# Altium project OCP-TimeCardMini-TI.PrjPcb (part 1 of 6)
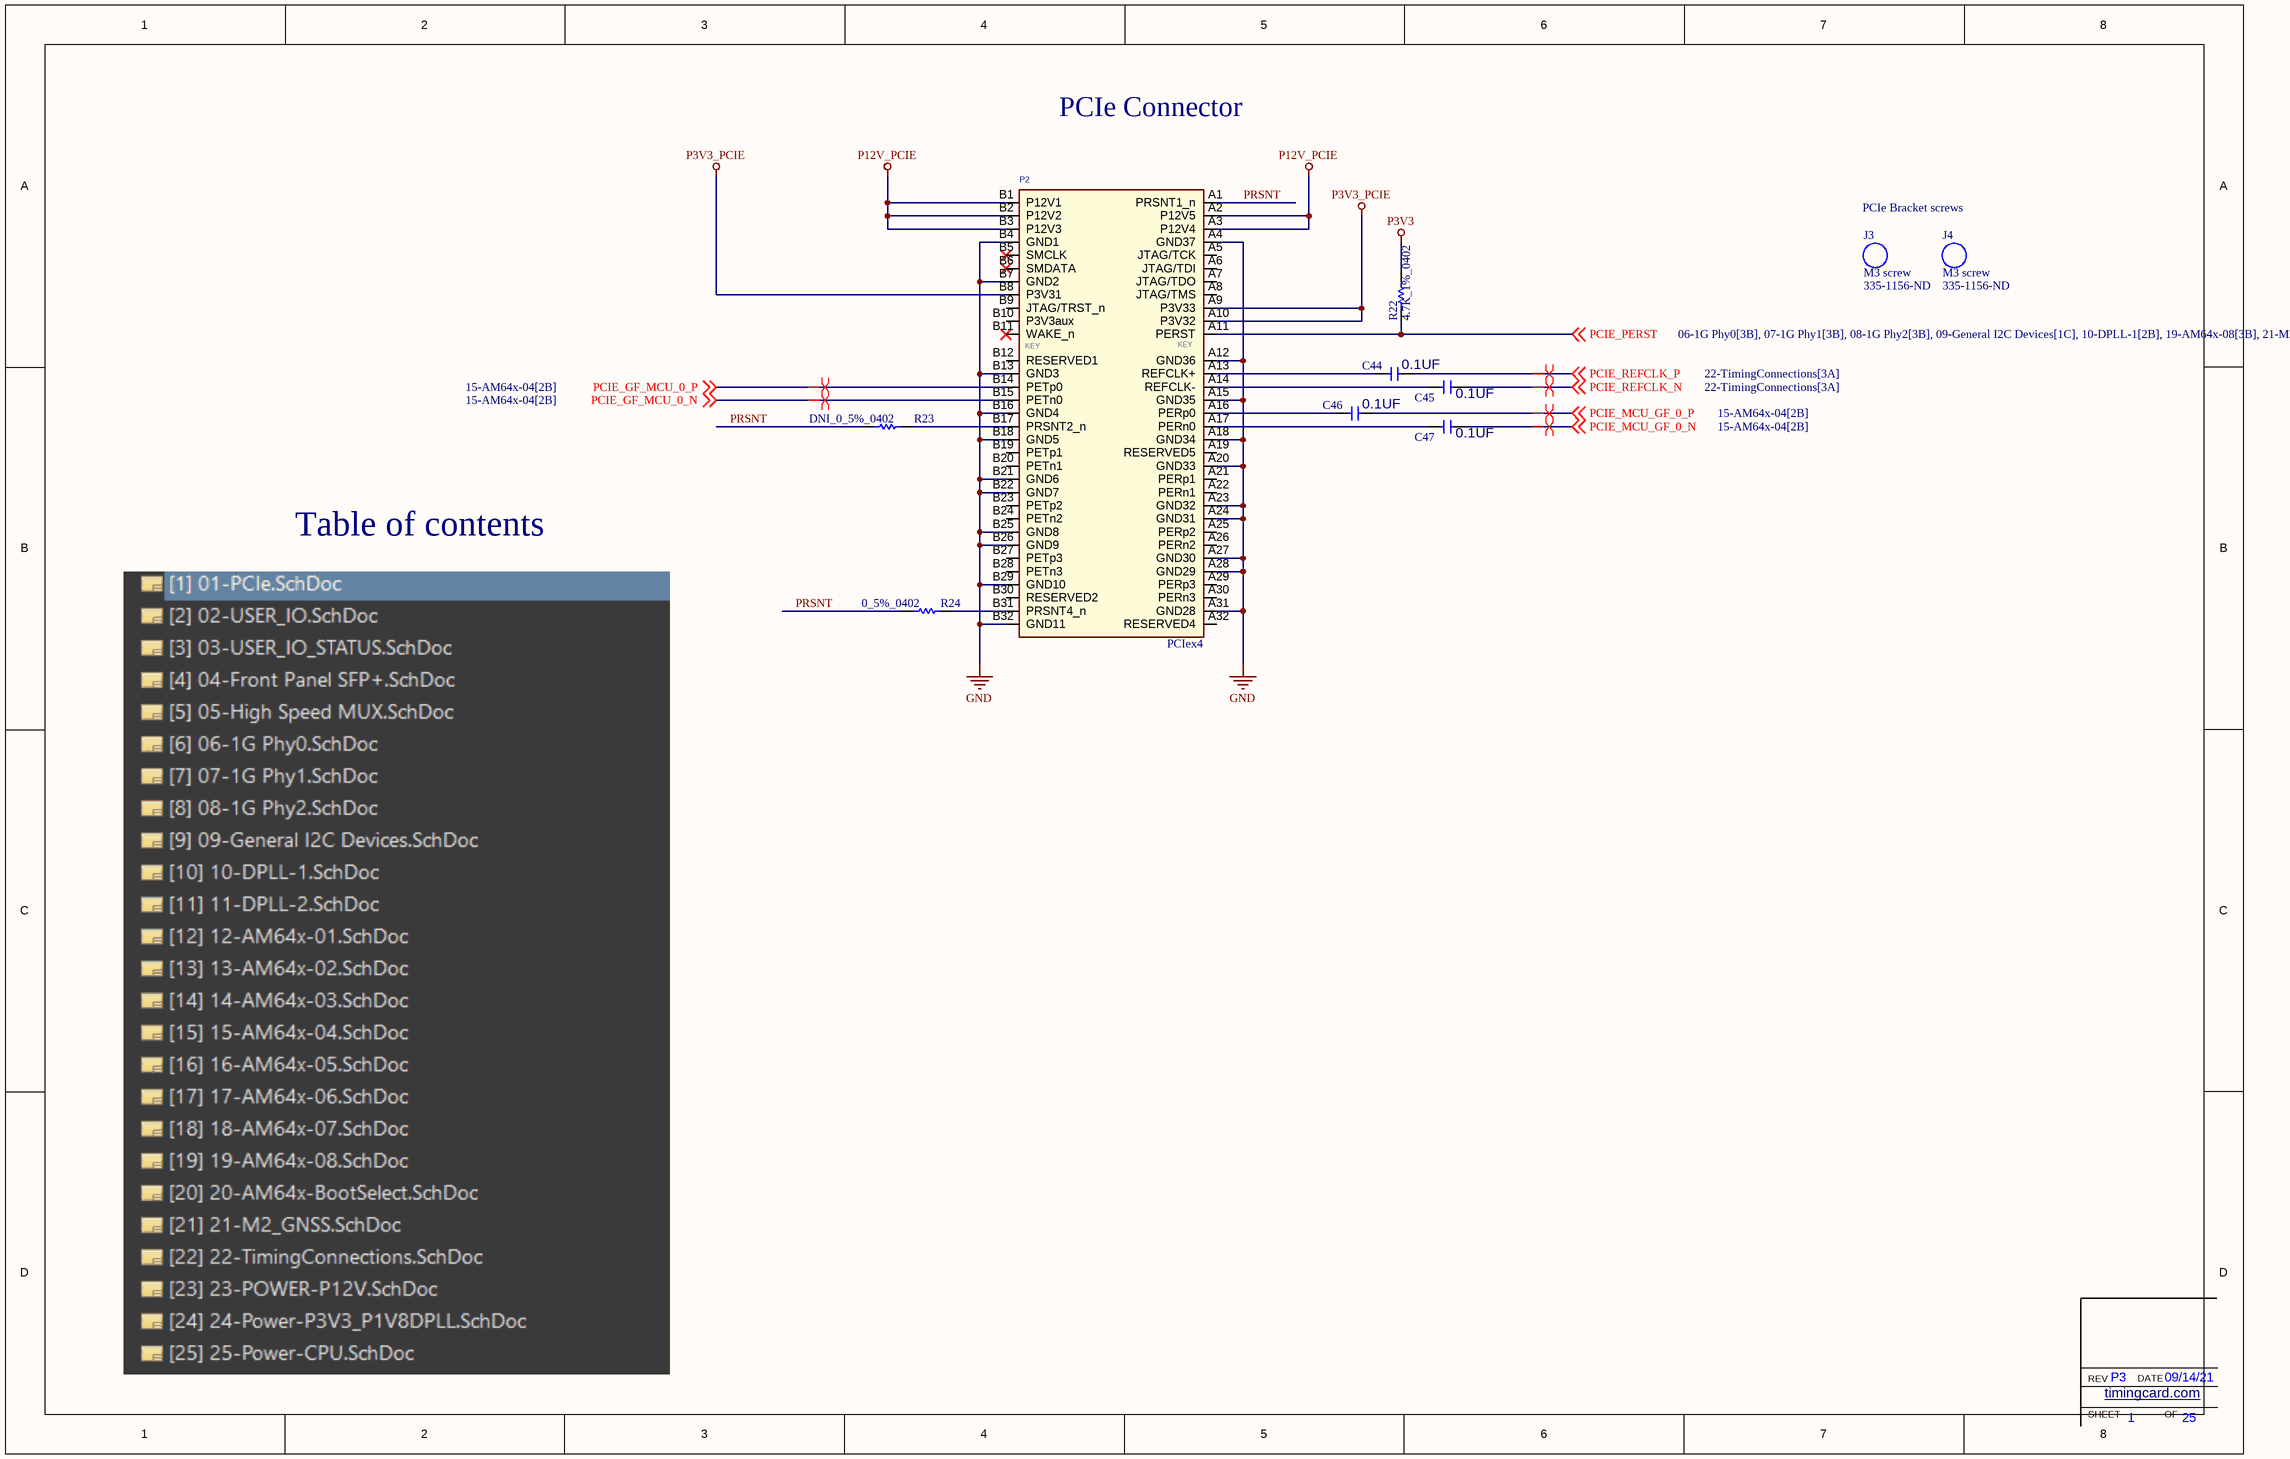
[diagram p0: 01-PCIe.SchDoc]
ProjectDate: 09/14/21; ProjectRevision: P3
25 sheets, 834 parts. Net scope: global (net labels, ports and power ports of the same name join across sheets).
Board file: OCP-TimeCardMini-TI_V1.PcbDoc
Sheets:
  01-PCIe.SchDoc
  02-USER_IO.SchDoc
  03-USER_IO_STATUS.SchDoc
  04-Front Panel SFP+.SchDoc
  05-High Speed MUX.SchDoc
  06-1G Phy0.SchDoc
  07-1G Phy1.SchDoc
  08-1G Phy2.SchDoc
  09-General I2C Devices.SchDoc
  10-DPLL-1.SchDoc
  11-DPLL-2.SchDoc
  12-AM64x-01.SchDoc
  13-AM64x-02.SchDoc
  14-AM64x-03.SchDoc
  15-AM64x-04.SchDoc
  16-AM64x-05.SchDoc
  17-AM64x-06.SchDoc
  18-AM64x-07.SchDoc
  19-AM64x-08.SchDoc
  20-AM64x-BootSelect.SchDoc
  21-M2_GNSS.SchDoc
  22-TimingConnections.SchDoc
  23-POWER-P12V.SchDoc
  24-Power-P3V3_P1V8DPLL.SchDoc
  25-Power-CPU.SchDoc

## Sheet 01-PCIe.SchDoc
size Tabloid; Customer: 01910; SheetNumber: 1; SheetTotal: 25

### Parts
C44  value 0.1UF  [CAPC1005X06N]  (hidden comment: CAP_0402_0.1UF_50V)
C45  value 0.1UF  [CAPC1005X06N]  (hidden comment: CAP_0402_0.1UF_50V)
C46  value 0.1UF  [CAPC1005X06N]  (hidden comment: CAP_0402_0.1UF_50V)
C47  value 0.1UF  [CAPC1005X06N]  (hidden comment: CAP_0402_0.1UF_50V)
J3  M3 screw  Supplier Part Number 1: 335-1156-ND
J4  M3 screw  Supplier Part Number 1: 335-1156-ND
P2  PCIex4  [PCIE_4LANE_EDGE]
R22  4.7K_1%_0402  [RESC1005X40X25NL10T10]
R23  DNI_0_5%_0402  [RESC1005X40X25LL10T10]  (no BOM)
R24  0_5%_0402  [RESC1005X40X25LL10T10]

### Nets
GND: P2.A4(GND37) P2.A12(GND36) P2.A15(GND35) P2.A18(GND34) P2.A20(GND33) P2.A23(GND32) P2.A24(GND31) P2.A27(GND30) P2.A28(GND29) P2.A31(GND28) P2.B4(GND1) P2.B7(GND2) P2.B13(GND3) P2.B16(GND4) P2.B18(GND5) P2.B21(GND6) P2.B22(GND7) P2.B25(GND8) P2.B26(GND9) P2.B29(GND10) P2.B32(GND11)
P3V3: R22.2
P3V3_PCIE: P2.A9(P3V33) P2.A10(P3V32) P2.B8(P3V31)
P12V_PCIE: P2.A2(P12V5) P2.A3(P12V4) P2.B1(P12V1) P2.B2(P12V2) P2.B3(P12V3)
PCIE_GF_MCU_0_N: P2.B15(PETn0) ; off-sheet PCIE_GF_MCU_0_N
PCIE_GF_MCU_0_P: P2.B14(PETp0) ; off-sheet PCIE_GF_MCU_0_P
PCIE_MCU_GF_0_N: C47.2 ; off-sheet PCIE_MCU_GF_0_N
PCIE_MCU_GF_0_P: C46.2 ; off-sheet PCIE_MCU_GF_0_P
PCIE_PERST: P2.A11(PERST) R22.1 ; off-sheet PCIE_PERST
PCIE_REFCLK_N: C45.2 ; off-sheet PCIE_REFCLK_N
PCIE_REFCLK_P: C44.2 ; off-sheet PCIE_REFCLK_P
PRSNT: P2.A1(PRSNT1_n) R23.1 R24.1
NetC44_1: C44.1 P2.A13(REFCLK+)
NetC45_1: C45.1 P2.A14(REFCLK-)
NetC46_1: C46.1 P2.A16(PERp0)
NetC47_1: C47.1 P2.A17(PERn0)
NetP2_B17: P2.B17(PRSNT2_n) R23.2
NetP2_B31: P2.B31(PRSNT4_n) R24.2

Not connected (* = marked no-connect by the designer): P2 A5(JTAG/TCK) A6(JTAG/TDI) A7(JTAG/TDO) A8(JTAG/TMS) A19(RESERVED5) A21(PERp1) A22(PERn1) A25(PERp2) A26(PERn2) A29(PERp3) A30(PERn3) A32(RESERVED4) B5(SMCLK)* B6(SMDATA)* B9(JTAG/TRST_n) B10(P3V3aux) B11(WAKE_n)* B12(RESERVED1) B19(PETp1) B20(PETn1) B23(PETp2) B24(PETn2) B27(PETp3) B28(PETn3) B30(RESERVED2)

### Layout directives
differential pair: PCIE_GF_MCU_0_N, PCIE_GF_MCU_0_P, PCIE_MCU_GF_0_N, PCIE_MCU_GF_0_P, PCIE_REFCLK_N, PCIE_REFCLK_P

### Notes on the sheet
- PCIe Connector
- PCIe Bracket screws
- Table of contents
- SHEET
- REV
- timingcard.com <http://timingcard.com>
- DATE
- OF
- (in symbol PCIex4) KEY

### Library data of the parts
C44-C47 = CAP_0402_0.1UF_50V: CAP, CER, 0.1UF, 50V, 10%, X7R, AEC-Q200, 0402; MFG PART NUM: CGA2B3X7R1H104K050BB; VALENTIUM PART NUM: <VALENTIUM>; MFG NAME: TDK; MAXTEMP: 125C; MINTEMP: -55C; CATEGORY: CAP, CER; MODIFY DATE: 10/23/2013; SHEETPART: *; P1: 10%; OTHER: AEC-Q200; P2: 50V; P3: X7R; Size: 0402; DESC: CAP, CER, 0.1UF, 50V, 10%, X7R, AEC-Q200, 0402; Supplier 1: Digi-Key; Supplier Part Number 1: 445-6899-1-ND
P2 = PCIex4: PCIE x4 Edge Connector,OrCAD Symbol,NC; Part Number: 451; Manufacturer: NA; NOTE: NC; Vendor P/N: NA; Part Type: SMT
R22 = CMP-2002-05217-1: Manufacturer: Bourns; Part Number: CR0402-FX-4701GLF
R23 R24 = CMP-2002-04569-1: Manufacturer: KOA Speer; Part Number: RK73Z1ETTP
J3 J4 = M3 screw: Supplier 1: Digi-Key

## Sheet 02-USER_IO.SchDoc
size Tabloid; DocumentNumber: 1; SheetNumber: 2; SheetTotal: 24
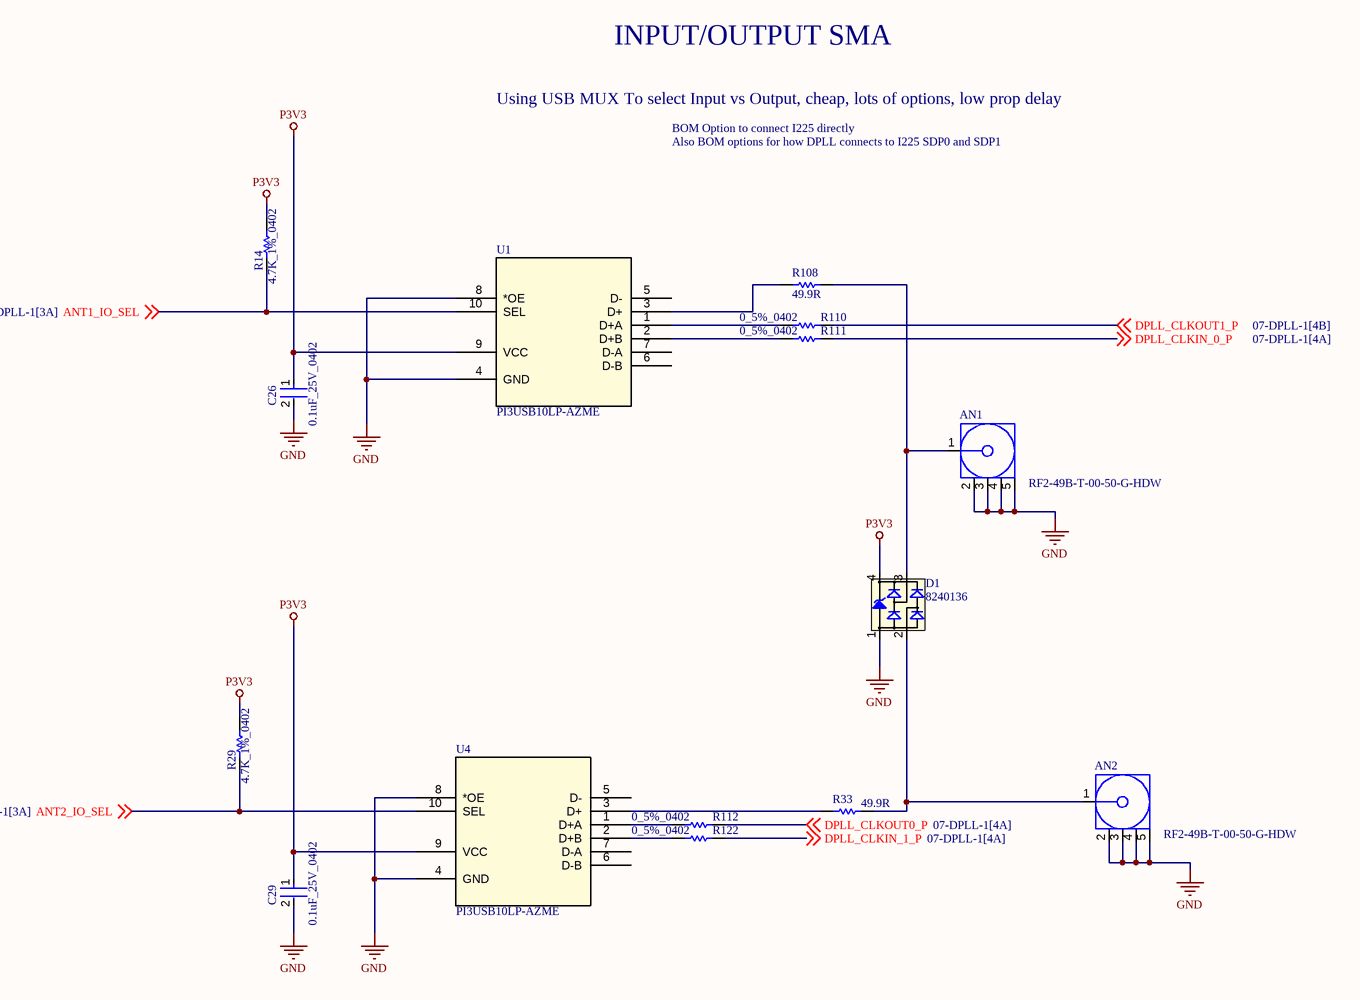
[diagram p1: 02-USER_IO.SchDoc]

### Parts
AN1  RF2-49B-T-00-50-G-HDW  [AMPH-901-143-6RFX_V]
AN2  RF2-49B-T-00-50-G-HDW  [AMPH-901-143-6RFX_V]
C26  0.1uF_25V_0402  [FP-0402-L_1_0_1-W_0_5_0_1-IPC_C]
C29  0.1uF_25V_0402  [FP-0402-L_1_0_1-W_0_5_0_1-IPC_C]
D1  8240136  [SOT143-4L]
R14  4.7K_1%_0402  [RESC1005X40X25NL10T10]
R29  4.7K_1%_0402  [RESC1005X40X25NL10T10]
R33  49.9R  [RESC1608X55X25NL10T15]
R108  49.9R  [RESC1608X55X25NL10T15]
R110  0_5%_0402  [RESC1005X40X25LL10T10]
R111  0_5%_0402  [RESC1005X40X25LL10T10]
R112  0_5%_0402  [RESC1005X40X25LL10T10]
R122  0_5%_0402  [RESC1005X40X25LL10T10]
U1  PI3USB10LP-AZME  [ZM10_PER]
U4  PI3USB10LP-AZME  [ZM10_PER]

### Nets
GND: AN1.2 AN1.3 AN1.4 AN1.5 AN2.2 AN2.3 AN2.4 AN2.5 C26.2 C29.2 D1.1(GND) U1.4(GND) U1.8(*OE) U4.4(GND) U4.8(*OE)
P3V3: C26.1 C29.1 D1.4(VDD) R14.1 R29.1 U1.9(VCC) U4.9(VCC)
ANT1_IO_SEL: R14.2 U1.10(SEL) ; off-sheet ANT1_IO_SEL
ANT2_IO_SEL: R29.2 U4.10(SEL) ; off-sheet ANT2_IO_SEL
DPLL_CLKIN_0_P: R111.2 ; off-sheet DPLL_CLKIN_0_P
DPLL_CLKIN_1_P: R122.2 ; off-sheet DPLL_CLKIN_1_P
DPLL_CLKOUT0_P: R112.2 ; off-sheet DPLL_CLKOUT0_P
DPLL_CLKOUT1_P: R110.2 ; off-sheet DPLL_CLKOUT1_P
NetAN1_1: AN1.1 D1.3(I/O2) R108.1
NetAN2_1: AN2.1 D1.2(I/O1) R33.2
NetR33_1: R33.1 U4.3(D+)
NetR108_2: R108.2 U1.3(D+)
NetR110_1: R110.1 U1.1(D+A)
NetR111_1: R111.1 U1.2(D+B)
NetR112_1: R112.1 U4.1(D+A)
NetR122_1: R122.1 U4.2(D+B)

Not connected (* = marked no-connect by the designer): U1 5(D-) 6(D-B) 7(D-A); U4 5(D-) 6(D-B) 7(D-A)

### Notes on the sheet
- Using USB MUX To select Input vs Output, cheap, lots of options, low prop delay
- INPUT/OUTPUT SMA
- BOM Option to connect I225 directly
- Also BOM options for how DPLL connects to I225 SDP0 and SDP1
- SHEET
- REV
- timingcard.com <http://timingcard.com>
- DATE
- OF

### Library data of the parts
AN1 AN2 = CMP-2000-05705-1: Coaxial connector, 50 Ohm, -65 to 165 degC, 5-Pin THD, RoHS, Bulk; Manufacturer: Amphenol; Catalog Drawings: 901-143-6RFXMountingHole; 3D Model: 901-143-6RFX.igs; Body Material: Brass; Connector Type: Jack,FemaleSocket; Shield Termination: Solder; Other Names: 901-143-6-RFX9011436RFXARFX1232; Online Catalog: SMA,RFX; Frequency - Max: 18GHz; Body Finish: Gold; Dielectric Material: Polytetrafluoroethylene(PTFE); Center Contact Material: BerylliumCopper; Impedance: 50Ohm; Connector Style: SMA; Mounting Technology: ThroughHole; Mounting Type: ThroughHole,RightAngle; Cable Group: -; Series: -; Package Description: 5-Pin Through Hole Device, Body 7 x 7 mm, Pitch 2.54 mm; Package Reference: 901-143-6RFX; Voltage Rating: -; Standard Package: 1; Fastening Type: Threaded; Housing Color: Gold; Datasheet URL: http://www.amphenolrf.com/downloads/dl/file/id/2712/product/3102/901_143_6rfx_customer_drawing.pdf; Family: CoaxialConnectors(RF); Contact Termination: Solder; Manufacturer URL: http://www.amphenol.com/; Operating Temperature: -65°C~165°C; Category: Connectors,Interconnects; Packaging: Bulk; Features: -; Center Contact Plating: Gold; Datasheet Version: Rev. C, 06/2010; Ingress Protection: -
C26 C29 = CMP-2008-02519-2: General Purpose Ceramic Capacitor, 0402, 100nF, 10%, X7R, 15%, 25V; Package Quantity: 1; Capacitance: 100nF; Min Operating Temperature: -55°C; Voltage: 25V; Voltage Rating: 25V; Construction: Flat; Max Operating Temperature: 125°C; Radiation Hardening: No; Depth: 0.5mm; Thickness: 0.022inch; Voltage Rating (DC): 25V; Number of Pins: 2; Lead Free: Lead Free; Series: -; REACH SVHC: No SVHC; Length: 1mm; Dielectric: X7R; RoHS Compliant: Yes; Mount: Surface Mount; Packaging: Tape and Reel; Case/Package: 0402; Case Code (Imperial): 0402; Termination: SMD/SMT; Width: 0.02inch; Case Code (Metric): 1005; Tolerance: 10%
D1 = CMP-1486-00002-1: TVS Diode WE-TVS-HS, VRWM=3.3V; Manufacturer: Wuerth Elektronik; Reverse Stand Off Voltage: 3.3V; PartNumber: 8240136; ComponentLink1Description: Manufacturer URL; PackageReference: SOT143-4L; ComponentLink1URL: http://www.we-online.com; ComponentLink2Description: Datasheet; ComponentLink2URL: http://katalog.we-online.de/kataloge/eisos/media/pdf/8240136.pdf
R14 R29 = CMP-2002-05217-1: as R22 on sheet 01-PCIe
R33 R108 = CMP-1659-00036-1: General Purpose Chip Resistor, 49.9 Ohm, +/- 1%, -55 to 155 degC, 0603 (1608 Metric), RoHS, Tape and Reel; Max Supply Voltage: 3.63 V; Case\Package: LQFP; Interface: SPI; Min Supply Voltage: 2.97 V; PackageReference: 0603; Packaging: Tray; ComponentLink2Description: Datasheet; ComponentLink1Description: Manufacturer URL; ComponentLink2URL: https://datasheet.ciiva.com/11808/0900766b80f96399-11808223.pdf; RoHSCompliant: true; Max Operating Temperature: 85 degC; ComponentLink1URL: http://www.yageo.com/; PackageDescription: 2-Pin Surface Mount Device, Body 1.6 x 0.8 mm; DatasheetVersion: Rev. 4, 04/2009; Min Operating Temperature: -40 degC; Package Quantity: 250; Pins: 48
R110-R112 R122 = CMP-2002-04569-1: as R23 on sheet 01-PCIe
U1 U4 = PI3USB10LP-AZME: No Description Available; Mfr_Name: Pericom; RefDes: RefDes; Type: Type

## Sheet 03-USER_IO_STATUS.SchDoc: Time Card
size B; SheetNumber: 3; SheetTotal: 25; ENG_APP_DATE: --/--/--; DSN_APP_DATE: --/--/--; CHK_APP_DATE: --/--/--
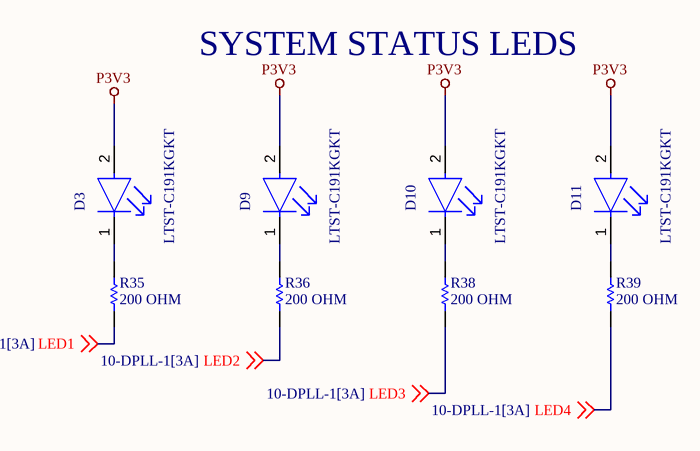
[diagram p2: 03-USER_IO_STATUS.SchDoc]

### Parts
D3  LTST-C191KGKT  [FP-LTST-C191KGKT-MFG]
D9  LTST-C191KGKT  [FP-LTST-C191KGKT-MFG]
D10  LTST-C191KGKT  [FP-LTST-C191KGKT-MFG]
D11  LTST-C191KGKT  [FP-LTST-C191KGKT-MFG]
R35  200 OHM  [RESC1608X55X30NL15T15]
R36  200 OHM  [RESC1608X55X30NL15T15]
R38  200 OHM  [RESC1608X55X30NL15T15]
R39  200 OHM  [RESC1608X55X30NL15T15]

### Nets
P3V3: D3.2(A) D9.2(A) D10.2(A) D11.2(A)
LED1: R35.1 ; off-sheet LED1
LED2: R36.1 ; off-sheet LED2
LED3: R38.1 ; off-sheet LED3
LED4: R39.1 ; off-sheet LED4
NetD3_1: D3.1(C) R35.2
NetD9_1: D9.1(C) R36.2
NetD10_1: D10.1(C) R38.2
NetD11_1: D11.1(C) R39.2

### Notes on the sheet
- SYSTEM STATUS LEDS
- DWG. NO.
- REV.
- SHT.
- THIS DOCUMENT AND THE DATA DISCLOSED HEREIN OR HEREWITH IS THE PROPERTY OF ALTIUM LIMITED AND MAY BE FREELY DISTRIBUTED IN WHOLE. NO RIGHTS ARE RESERVED OR EXPRESS OR IMPLIED WARANTEE GIVEN.
- REVISION
- DESCRIPTION
- DATE
- APPROVED
- ENG:
- APPROVALS
- PROJECT
- DSN:
- CHK:
- REFERENCE DOCUMENTS
- PROJECT REVISION:
- TITLE
- DOCUMENT REVISION:
- DESIGN ITEM:
- BOM:
- FAB DWG:
- PCB DWG:
- ASSY DWG:
- SCALE:
- SIZE
- B
- CAGE CODE
- FILE NAME
- DWG NO.
- SHEET
- OF
- REV

### Library data of the parts
D3 D9-D11 = CMP-2000-05198-2: LED GREEN CLEAR SMD; Max Power Dissipation: 75mW; Forward Current: 30mA; Reverse Voltage: 5V; Lens Color: Colorless; Forward Voltage: 2V; Dominant Wavelength: 571nm; Number of LEDs: 1; Viewing Angle: 130°; Lens Style: Rectangular; Test Current: 20mA; Luminous Intensity: 35mcd; Wavelength: 574nm; Width: 0.8mm; Case Code (Imperial): 0603; Number of Pins: 2; Lead Free: Lead Free; Packaging: Tape and Reel; Package Quantity: 1; Min Operating Temperature: -55°C; Case/Package: 0603; Length: 1.6mm; Power Dissipation: 75mW; Depth: 0.8mm; Radiation Hardening: No; Mount: Surface Mount; Max Operating Temperature: 85°C; Color: Green; Power Rating: 75mW; Height: 0.55mm; Illumination Color: Green; Case Code (Metric): 1608; Lens Transparency: Clear; Number of Elements: 1
R35 R36 R38 R39 = CMP-2000-00316-1: ERJ-3EKF2000V; Manufacturer: Panasonic; Part Number: ERJ-3EKF2000V

## Sheet 04-Front Panel SFP+.SchDoc
size Tabloid; Customer: 01910; SheetNumber: 4; SheetTotal: 25
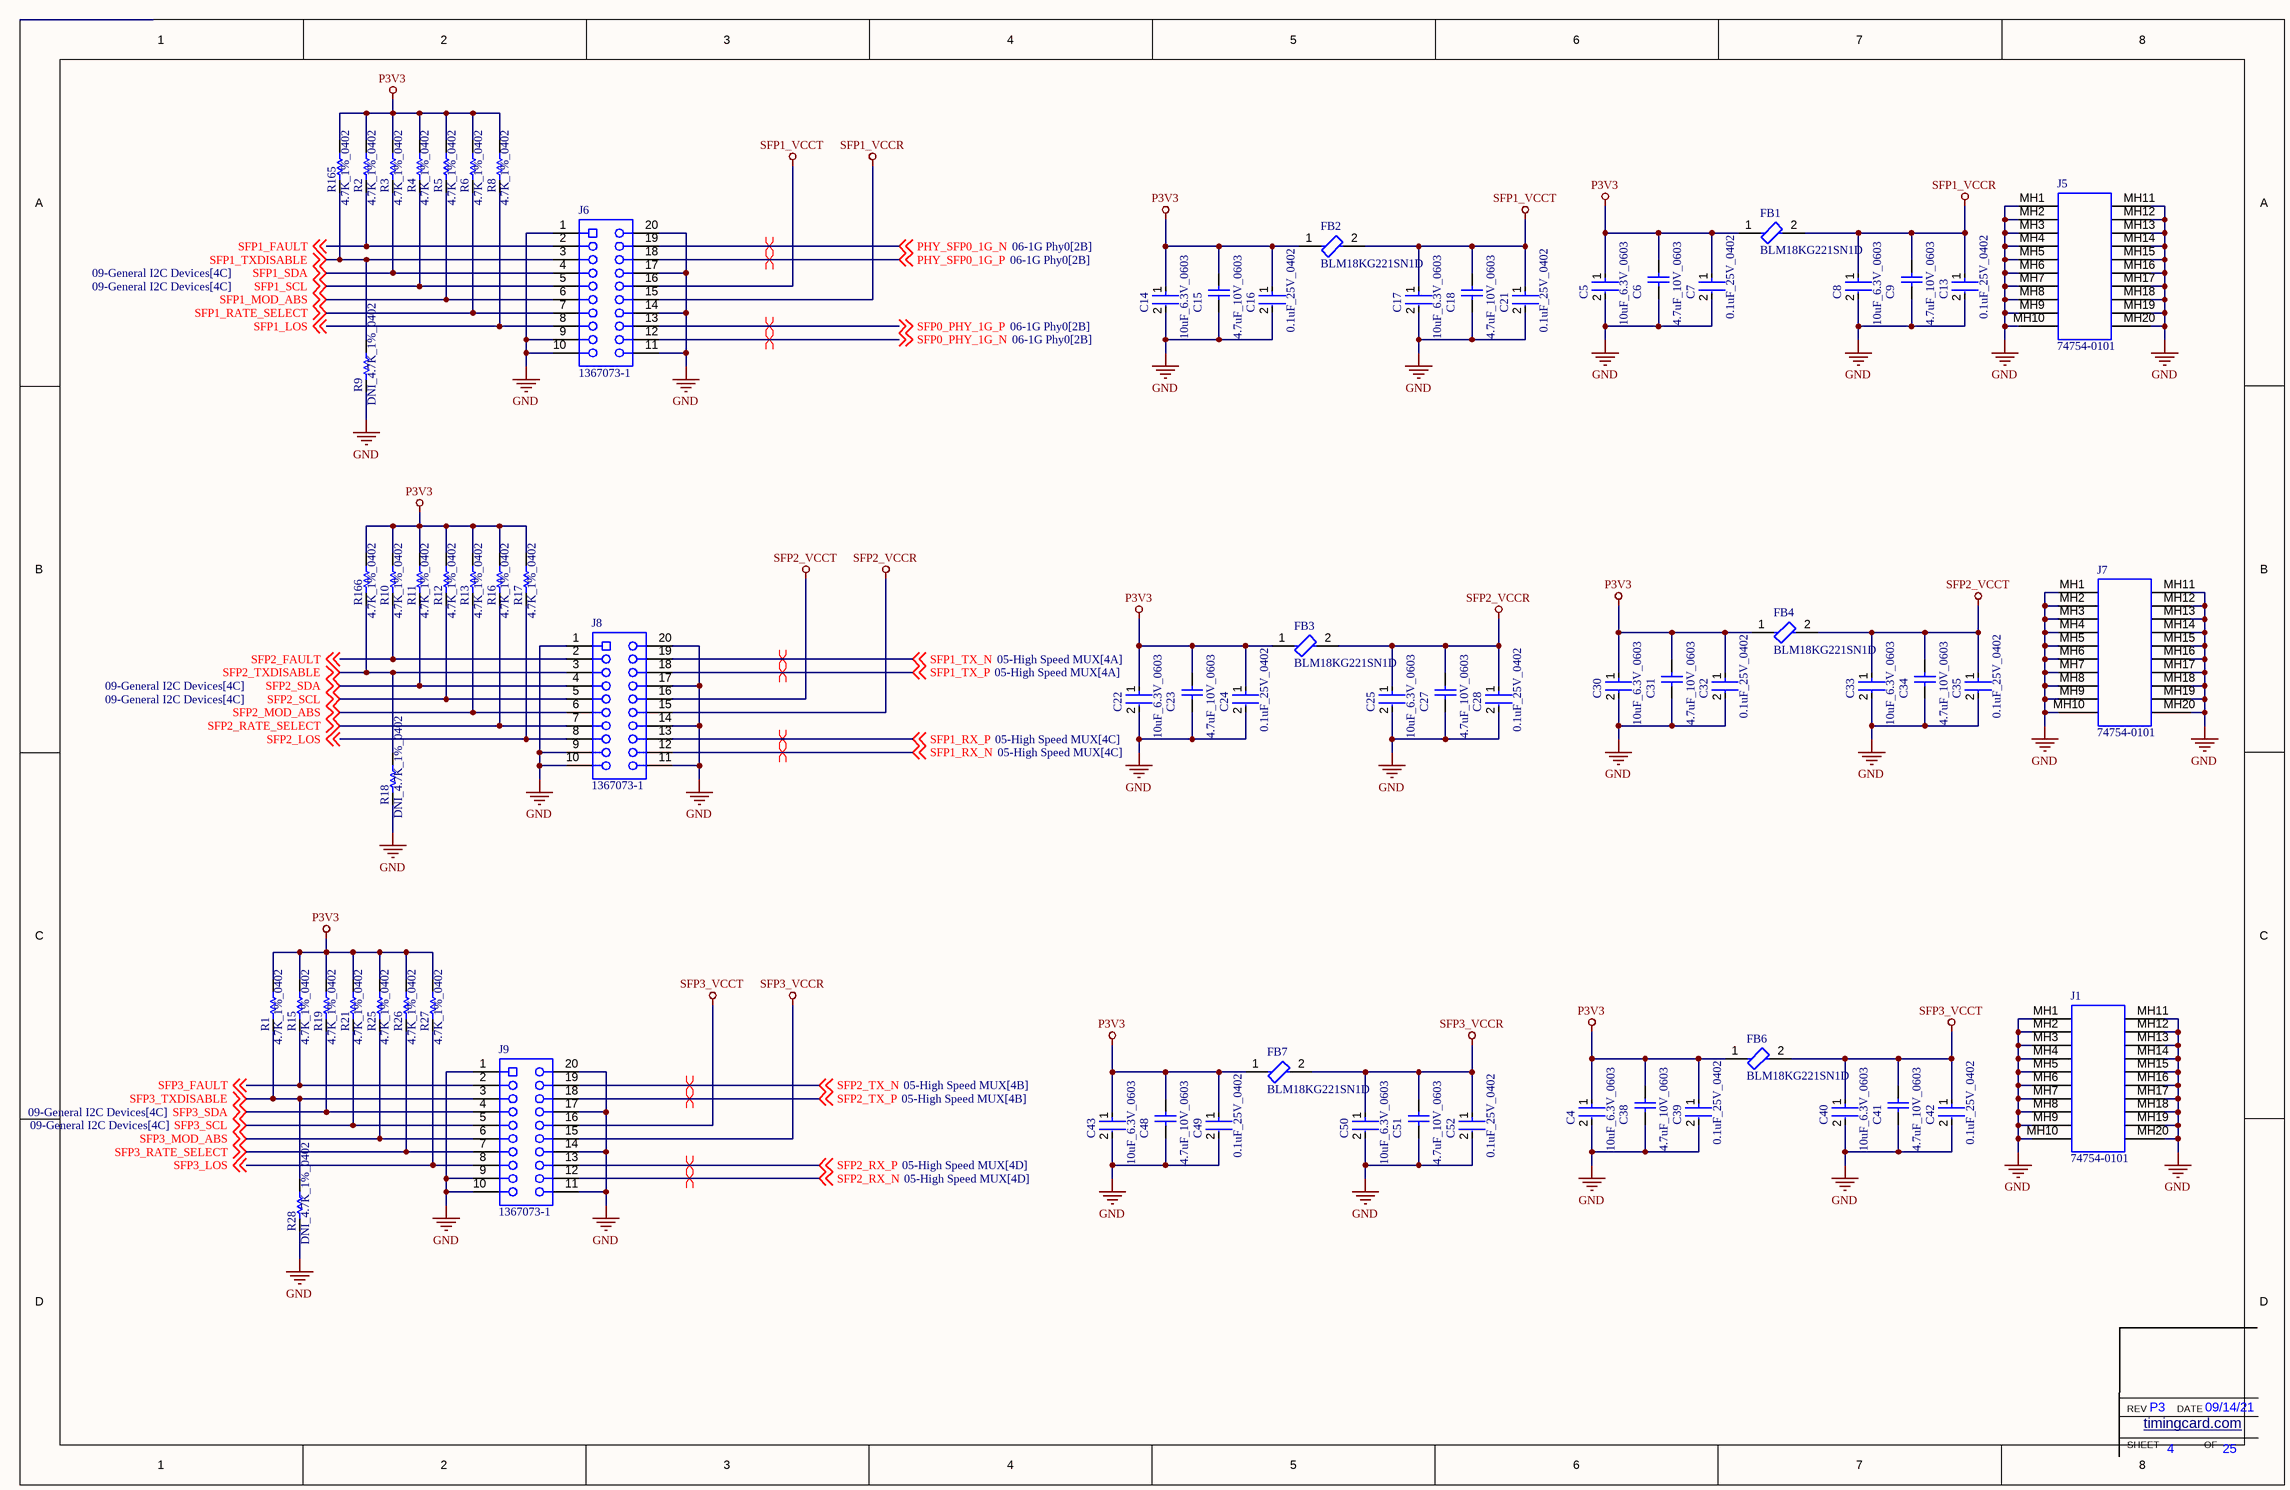
[diagram p3: 04-Front Panel SFP+.SchDoc]

### Parts
C4  10uF_6.3V_0603  [FP-C0603C106M9PACTU-MFG]
C5  10uF_6.3V_0603  [FP-C0603C106M9PACTU-MFG]
C6  4.7uF_10V_0603  [CAPC1608X87X35NL15T15]
C7  0.1uF_25V_0402  [FP-0402-L_1_0_1-W_0_5_0_1-IPC_C]
C8  10uF_6.3V_0603  [FP-C0603C106M9PACTU-MFG]
C9  4.7uF_10V_0603  [CAPC1608X87X35NL15T15]
C13  0.1uF_25V_0402  [FP-0402-L_1_0_1-W_0_5_0_1-IPC_C]
C14  10uF_6.3V_0603  [FP-C0603C106M9PACTU-MFG]
C15  4.7uF_10V_0603  [CAPC1608X87X35NL15T15]
C16  0.1uF_25V_0402  [FP-0402-L_1_0_1-W_0_5_0_1-IPC_C]
C17  10uF_6.3V_0603  [FP-C0603C106M9PACTU-MFG]
C18  4.7uF_10V_0603  [CAPC1608X87X35NL15T15]
C21  0.1uF_25V_0402  [FP-0402-L_1_0_1-W_0_5_0_1-IPC_C]
C22  10uF_6.3V_0603  [FP-C0603C106M9PACTU-MFG]
C23  4.7uF_10V_0603  [CAPC1608X87X35NL15T15]
C24  0.1uF_25V_0402  [FP-0402-L_1_0_1-W_0_5_0_1-IPC_C]
C25  10uF_6.3V_0603  [FP-C0603C106M9PACTU-MFG]
C27  4.7uF_10V_0603  [CAPC1608X87X35NL15T15]
C28  0.1uF_25V_0402  [FP-0402-L_1_0_1-W_0_5_0_1-IPC_C]
C30  10uF_6.3V_0603  [FP-C0603C106M9PACTU-MFG]
C31  4.7uF_10V_0603  [CAPC1608X87X35NL15T15]
C32  0.1uF_25V_0402  [FP-0402-L_1_0_1-W_0_5_0_1-IPC_C]
C33  10uF_6.3V_0603  [FP-C0603C106M9PACTU-MFG]
C34  4.7uF_10V_0603  [CAPC1608X87X35NL15T15]
C35  0.1uF_25V_0402  [FP-0402-L_1_0_1-W_0_5_0_1-IPC_C]
C38  4.7uF_10V_0603  [CAPC1608X87X35NL15T15]
C39  0.1uF_25V_0402  [FP-0402-L_1_0_1-W_0_5_0_1-IPC_C]
C40  10uF_6.3V_0603  [FP-C0603C106M9PACTU-MFG]
C41  4.7uF_10V_0603  [CAPC1608X87X35NL15T15]
C42  0.1uF_25V_0402  [FP-0402-L_1_0_1-W_0_5_0_1-IPC_C]
C43  10uF_6.3V_0603  [FP-C0603C106M9PACTU-MFG]
C48  4.7uF_10V_0603  [CAPC1608X87X35NL15T15]
C49  0.1uF_25V_0402  [FP-0402-L_1_0_1-W_0_5_0_1-IPC_C]
C50  10uF_6.3V_0603  [FP-C0603C106M9PACTU-MFG]
C51  4.7uF_10V_0603  [CAPC1608X87X35NL15T15]
C52  0.1uF_25V_0402  [FP-0402-L_1_0_1-W_0_5_0_1-IPC_C]
FB1  BLM18KG221SN1D  [FP-BLM18-0_15-t0_8-IPC_B]
FB2  BLM18KG221SN1D  [FP-BLM18-0_15-t0_8-IPC_B]
FB3  BLM18KG221SN1D  [FP-BLM18-0_15-t0_8-IPC_B]
FB4  BLM18KG221SN1D  [FP-BLM18-0_15-t0_8-IPC_B]
FB6  BLM18KG221SN1D  [FP-BLM18-0_15-t0_8-IPC_B]
FB7  BLM18KG221SN1D  [FP-BLM18-0_15-t0_8-IPC_B]
J1  74754-0101  [MOLX-74754-0101_V]
J5  74754-0101  [MOLX-74754-0101_V]
J6  1367073-1  [TECO-1367073-1_V]
J7  74754-0101  [MOLX-74754-0101_V]
J8  1367073-1  [TECO-1367073-1_V]
J9  1367073-1  [TECO-1367073-1_V]
R1  4.7K_1%_0402  [RESC1005X40X25NL10T10]
R2  4.7K_1%_0402  [RESC1005X40X25NL10T10]
R3  4.7K_1%_0402  [RESC1005X40X25NL10T10]
R4  4.7K_1%_0402  [RESC1005X40X25NL10T10]
R5  4.7K_1%_0402  [RESC1005X40X25NL10T10]
R6  4.7K_1%_0402  [RESC1005X40X25NL10T10]
R8  4.7K_1%_0402  [RESC1005X40X25NL10T10]
R9  DNI_4.7K_1%_0402  [RESC1005X40X25NL10T10]  (no BOM)
R10  4.7K_1%_0402  [RESC1005X40X25NL10T10]
R11  4.7K_1%_0402  [RESC1005X40X25NL10T10]
R12  4.7K_1%_0402  [RESC1005X40X25NL10T10]
R13  4.7K_1%_0402  [RESC1005X40X25NL10T10]
R15  4.7K_1%_0402  [RESC1005X40X25NL10T10]
R16  4.7K_1%_0402  [RESC1005X40X25NL10T10]
R17  4.7K_1%_0402  [RESC1005X40X25NL10T10]
R18  DNI_4.7K_1%_0402  [RESC1005X40X25NL10T10]  (no BOM)
R19  4.7K_1%_0402  [RESC1005X40X25NL10T10]
R21  4.7K_1%_0402  [RESC1005X40X25NL10T10]
R25  4.7K_1%_0402  [RESC1005X40X25NL10T10]
R26  4.7K_1%_0402  [RESC1005X40X25NL10T10]
R27  4.7K_1%_0402  [RESC1005X40X25NL10T10]
R28  DNI_4.7K_1%_0402  [RESC1005X40X25NL10T10]  (no BOM)
R165  4.7K_1%_0402  [RESC1005X40X25NL10T10]
R166  4.7K_1%_0402  [RESC1005X40X25NL10T10]

### Nets
GND: C4.2 C5.2 C6.1 C7.2 C8.2 C9.1 C13.2 C14.2 C15.1 C16.2 C17.2 C18.1 C21.2 C22.2 C23.1 C24.2 C25.2 C27.1 C28.2 C30.2 C31.1 C32.2 C33.2 C34.1 C35.2 C38.1 C39.2 C40.2 C41.1 C42.2 C43.2 C48.1 C49.2 C50.2 C51.1 C52.2 J1.MH1 J1.MH2 J1.MH3 J1.MH4 J1.MH5 J1.MH6 J1.MH7 J1.MH8 J1.MH9 J1.MH10 J1.MH11 J1.MH12 J1.MH13 J1.MH14 J1.MH15 J1.MH16 J1.MH17 J1.MH18 J1.MH19 J1.MH20 J5.MH1 J5.MH2 J5.MH3 J5.MH4 J5.MH5 J5.MH6 J5.MH7 J5.MH8 J5.MH9 J5.MH10 J5.MH11 J5.MH12 J5.MH13 J5.MH14 J5.MH15 J5.MH16 J5.MH17 J5.MH18 J5.MH19 J5.MH20 J6.1 J6.9 J6.10 J6.11 J6.14 J6.17 J6.20 J7.MH1 J7.MH2 J7.MH3 J7.MH4 J7.MH5 J7.MH6 J7.MH7 J7.MH8 J7.MH9 J7.MH10 J7.MH11 J7.MH12 J7.MH13 J7.MH14 J7.MH15 J7.MH16 J7.MH17 J7.MH18 J7.MH19 J7.MH20 J8.1 J8.9 J8.10 J8.11 J8.14 J8.17 J8.20 J9.1 J9.9 J9.10 J9.11 J9.14 J9.17 J9.20 R9.2 R18.2 R28.2
P3V3: C4.1 C5.1 C6.2 C7.1 C14.1 C15.2 C16.1 C22.1 C23.2 C24.1 C30.1 C31.2 C32.1 C38.2 C39.1 C43.1 C48.2 C49.1 FB1.1 FB2.1 FB3.1 FB4.1 FB6.1 FB7.1 R1.1 R2.1 R3.1 R4.1 R5.1 R6.1 R8.1 R10.1 R11.1 R12.1 R13.1 R15.1 R16.1 R17.1 R19.1 R21.1 R25.1 R26.1 R27.1 R165.1 R166.1
SFP1_VCCR: C8.1 C9.2 C13.1 FB1.2 J6.15
SFP1_VCCT: C17.1 C18.2 C21.1 FB2.2 J6.16
SFP2_VCCR: C25.1 C27.2 C28.1 FB3.2 J8.15
SFP2_VCCT: C33.1 C34.2 C35.1 FB4.2 J8.16
SFP3_VCCR: C50.1 C51.2 C52.1 FB7.2 J9.15
SFP3_VCCT: C40.1 C41.2 C42.1 FB6.2 J9.16
PHY_SFP0_1G_N: J6.19 ; off-sheet PHY_SFP0_1G_N
PHY_SFP0_1G_P: J6.18 ; off-sheet PHY_SFP0_1G_P
SFP0_PHY_1G_N: J6.12 ; off-sheet SFP0_PHY_1G_N
SFP0_PHY_1G_P: J6.13 ; off-sheet SFP0_PHY_1G_P
SFP1_FAULT: J6.2 R2.2 ; off-sheet SFP1_FAULT
SFP1_LOS: J6.8 R8.2 ; off-sheet SFP1_LOS
SFP1_MOD_ABS: J6.6 R5.2 ; off-sheet SFP1_MOD_ABS
SFP1_RATE_SELECT: J6.7 R6.2 ; off-sheet SFP1_RATE_SELECT
SFP1_RX_N: J8.12 ; off-sheet SFP1_RX_N
SFP1_RX_P: J8.13 ; off-sheet SFP1_RX_P
SFP1_SCL: J6.5 R4.2 ; off-sheet SFP1_SCL
SFP1_SDA: J6.4 R3.2 ; off-sheet SFP1_SDA
SFP1_TX_N: J8.19 ; off-sheet SFP1_TX_N
SFP1_TX_P: J8.18 ; off-sheet SFP1_TX_P
SFP1_TXDISABLE: J6.3 R9.1 R165.2 ; off-sheet SFP1_TXDISABLE
SFP2_FAULT: J8.2 R10.2 ; off-sheet SFP2_FAULT
SFP2_LOS: J8.8 R17.2 ; off-sheet SFP2_LOS
SFP2_MOD_ABS: J8.6 R13.2 ; off-sheet SFP2_MOD_ABS
SFP2_RATE_SELECT: J8.7 R16.2 ; off-sheet SFP2_RATE_SELECT
SFP2_RX_N: J9.12 ; off-sheet SFP2_RX_N
SFP2_RX_P: J9.13 ; off-sheet SFP2_RX_P
SFP2_SCL: J8.5 R12.2 ; off-sheet SFP2_SCL
SFP2_SDA: J8.4 R11.2 ; off-sheet SFP2_SDA
SFP2_TX_N: J9.19 ; off-sheet SFP2_TX_N
SFP2_TX_P: J9.18 ; off-sheet SFP2_TX_P
SFP2_TXDISABLE: J8.3 R18.1 R166.2 ; off-sheet SFP2_TXDISABLE
SFP3_FAULT: J9.2 R15.2 ; off-sheet SFP3_FAULT
SFP3_LOS: J9.8 R27.2 ; off-sheet SFP3_LOS
SFP3_MOD_ABS: J9.6 R25.2 ; off-sheet SFP3_MOD_ABS
SFP3_RATE_SELECT: J9.7 R26.2 ; off-sheet SFP3_RATE_SELECT
SFP3_SCL: J9.5 R21.2 ; off-sheet SFP3_SCL
SFP3_SDA: J9.4 R19.2 ; off-sheet SFP3_SDA
SFP3_TXDISABLE: J9.3 R1.2 R28.1 ; off-sheet SFP3_TXDISABLE

### Layout directives
differential pair: PHY_SFP0_1G_N, PHY_SFP0_1G_P, SFP0_PHY_1G_N, SFP0_PHY_1G_P, SFP1_RX_N, SFP1_RX_P, SFP1_TX_N, SFP1_TX_P, SFP2_RX_N, SFP2_RX_P, SFP2_TX_N, SFP2_TX_P

### Notes on the sheet
- SHEET
- REV
- timingcard.com <http://timingcard.com>
- DATE
- OF

### Library data of the parts
C4 C5 C8 C14 C17 C22 C25 C30 C33 C40 C43 C50 = CMP-2006-02285-3: CAP CER 10UF 6.3V X5R 0603; Manufacturer Part Number: C0603C106M9PACTU; Manufacturer: Kemet; Material: Ceramic; Temperature Coefficient: 15%; Tolerance: 20%; Category: Cap; Height: 0.9mm; Digikey Description: CAP CER 10UF 6.3V X5R 0603; Mouser Description: In a Pack of 10, KEMET 0603 (1608M) 10µF MLCC 6.3V dc ±20% SMD C0603C106M9PACTU; Voltage Rating: 6.3V; Device Class L2: Capacitors; Temperature Range Low: -55°C; Temperature Characteristic: X5R; ComponentLink2Description: Datasheet; Ipc Land Pattern Name: CAPC16080X80; ComponentLink2URL: http://www.kemet.com/Lists/ProductCatalog/Attachments/19/KEM_C1006_X5R_SMD.pdf; Capacitance: 10uF; Temperature Range High: +85°C; Device Class L3: Ceramic Capacitors; RoHS: TRUE; Automotive: No; Value: 10uF; Temperature: -55°C to +85°C; Device Class L1: Passive Components; Package: C0603C106M9PACTU; Lead Free: Yes; Octopart: https://octopart.com/c0603c106m9pactu-kemet-8375727
C6 C9 C15 C18 C23 C27 C31 C34 C38 C41 C48 C51 = CMP-2006-03238-1: Part Number: C0603C475K8PACTU; Manufacturer: Kemet
C7 C13 C16 C21 C24 C28 C32 C35 C39 C42 C49 C52 = CMP-2008-02519-2: as C26 on sheet 02-USER_IO; Package Quantity: 1; Capacitance: 100nF; Min Operating Temperature: -55°C; Voltage: 25V; Voltage Rating: 25V; Construction: Flat; Max Operating Temperature: 125°C; Radiation Hardening: No; Depth: 0.5mm; Thickness: 0.022inch; Voltage Rating (DC): 25V; Number of Pins: 2; Lead Free: Lead Free; Series: -; REACH SVHC: No SVHC; Length: 1mm; Dielectric: X7R; RoHS Compliant: Yes; Mount: Surface Mount; Packaging: Tape and Reel; Case/Package: 0402; Case Code (Imperial): 0402; Termination: SMD/SMT; Width: 0.02inch; Case Code (Metric): 1005; Tolerance: 10%
FB1-FB4 FB6 FB7 = CMP-0686-00556-7: Chip Ferrite Bead, 0603, 220Ω @ 100MHz, 0.05Ω, 25%, 2.2A; DC Resistance (DCR): 50mR; Number of Circuits: 1; Impedance: 220R; Current Rating: 2.2A; Material: Ferrite; Test Frequency: 100MHz; Depth: 0.8mm; Series: BLM18K; RoHS Compliant: Yes; Termination: SMD/SMT; Max Current Rating: 2.2A; Case Code (Metric): 1608; Radiation Hardening: No; Number of Pins: 2; Length: 1.6mm; Lead Free: Lead Free; Package Quantity: 1; Height: 0.8mm; Core Material: Ferrite; Inductor Type: FERRITE BEAD; Min Operating Temperature: -55°C; Case/Package: 0603; Case Code (Imperial): 0603; Number of Lines: 1; Packaging: Tape and Reel; REACH SVHC: No SVHC; Max Operating Temperature: 125°C; Military Standard: Not; DC Resistance-Max: 50mR; Width: 0.8mm; DC Current: 2.2A; Max DC Current: 2.2A; Tolerance: 25%; Weight: 7.1E-05oz
J1 J5 J7 = CMP-1704-00003-3: SFP+ Cage, Single Port, Height 10.85 mm, Tail Height 3.05 mm, -40 to 85 degC, RoHS, Tray; RoHSCompliant: True; ComponentLink3URL: http://www.molex.com/pdm_docs/sd/747540101_sd.pdf; Width: 49 mm; Height: 10.85 mm; Mounting Technology: Through Hole; ComponentLink2Description: Datasheet; ComponentLink3Description: Package Specification; DatasheetVersion: Rev. Jul-15; Package Quantity: 1152; PackageDescription: SFP+ Cage, Single Port, Height 10.85 mm, Tail Height 3.05 mm; Radiation Hardening: No; PackageVersion: Rev. J, 02/2015; ComponentLink1Description: Manufacturer URL; PartNumber: 74754-0101; ComponentLink1URL: http://www.molex.com/; Packaging: Tray; Length: 15.9 mm; ComponentLink2URL: http://www.molex.com/webdocs/datasheets/pdf/en-us/0747540101_IO_CONNECTORS.pdf
J6 J8 J9 = CMP-2000-05488-1: Female Connector, Pitch 0.8 mm, 2 x 10 Position, Height 5.4 mm, -55 to 85 degC, RoHS, Tape and Reel; Manufacturer: TE Connectivity; Product Training Modules: HighSpeedPluggableI/OSolutions; 3D Model: 1367073-1.pdf; Connector Type: SFP; Other Names: A97430DKR; Mating Products: 516-2084-ND / -TXRXOPTICALSFF1.25GBDISCSI; Dynamic Catalog: SFPConnectors; Featured Product: HighSpeedPluggableI-OSolutions; Connector Style: Receptacle; Associated Product: A103997CT-ND / -CONNSFPCAGESINGLEW/OPIPE / A103997TR-ND / -CONNSFPCAGESINGLEW/OPIPE / 1367645-3-ND / -CONNCAGE&HEATSINKSGLPORTTIN / 1367645-2-ND / -CONNCAGE&HEATSINKSGLPORTTIN / 1888424-1-ND / -CONNCAGE1X2SFPENHANCEDEMI / 1367643-1-ND / -CONNCAGESNGLPORTDBLSIDETIN / 1489962-1-ND / -CONNSFPCAGESINGLEW/OPIPE / 1367645-1-ND / -CONNCAGE&HEATSINKSGLPORTTIN / A99375-ND / -CONNSFPCAGE1X4PIN-IN-PASTE / A97412CT-ND / -CONNSFPLOWERCAGEPCB / More...; Number of Positions: 20; Package Reference: 1367073-1; Package Description: Female Connector, Pitch 0.8 mm, 2 x 10 Position, Height 5.4 mm; RoHS Information: 1367073-1StatementofCompliance; Contact Finish: Gold; Datasheet URL: http://www.te.com/commerce/DocumentDelivery/DDEController?Action=showdoc&DocId=Customer+Drawing%7F1367073%7FK%7Fpdf%7FEnglish%7FENG_CD_1367073_K.pdf%7F1367073-1; Datasheet Version: Rev. K, 12/2012; Contact Finish Thickness: 15µin(0.38µm); Category: Connectors,Interconnects; Mounting Type: SurfaceMount,RightAngle; Mounting Technology: SurfaceMount; Packaging: Digi-Reel®; Manufacturer URL: http://www.te.com/; Family: PluggableConnectors; Standard Package: 1; Termination: Solder
R1-R6 R8-R13 R15-R19 R21 R25-R28 R165 R166 = CMP-2002-05217-1: as R22 on sheet 01-PCIe

## Sheet 05-High Speed MUX.SchDoc
size B; SheetNumber: 5; SheetTotal: 25
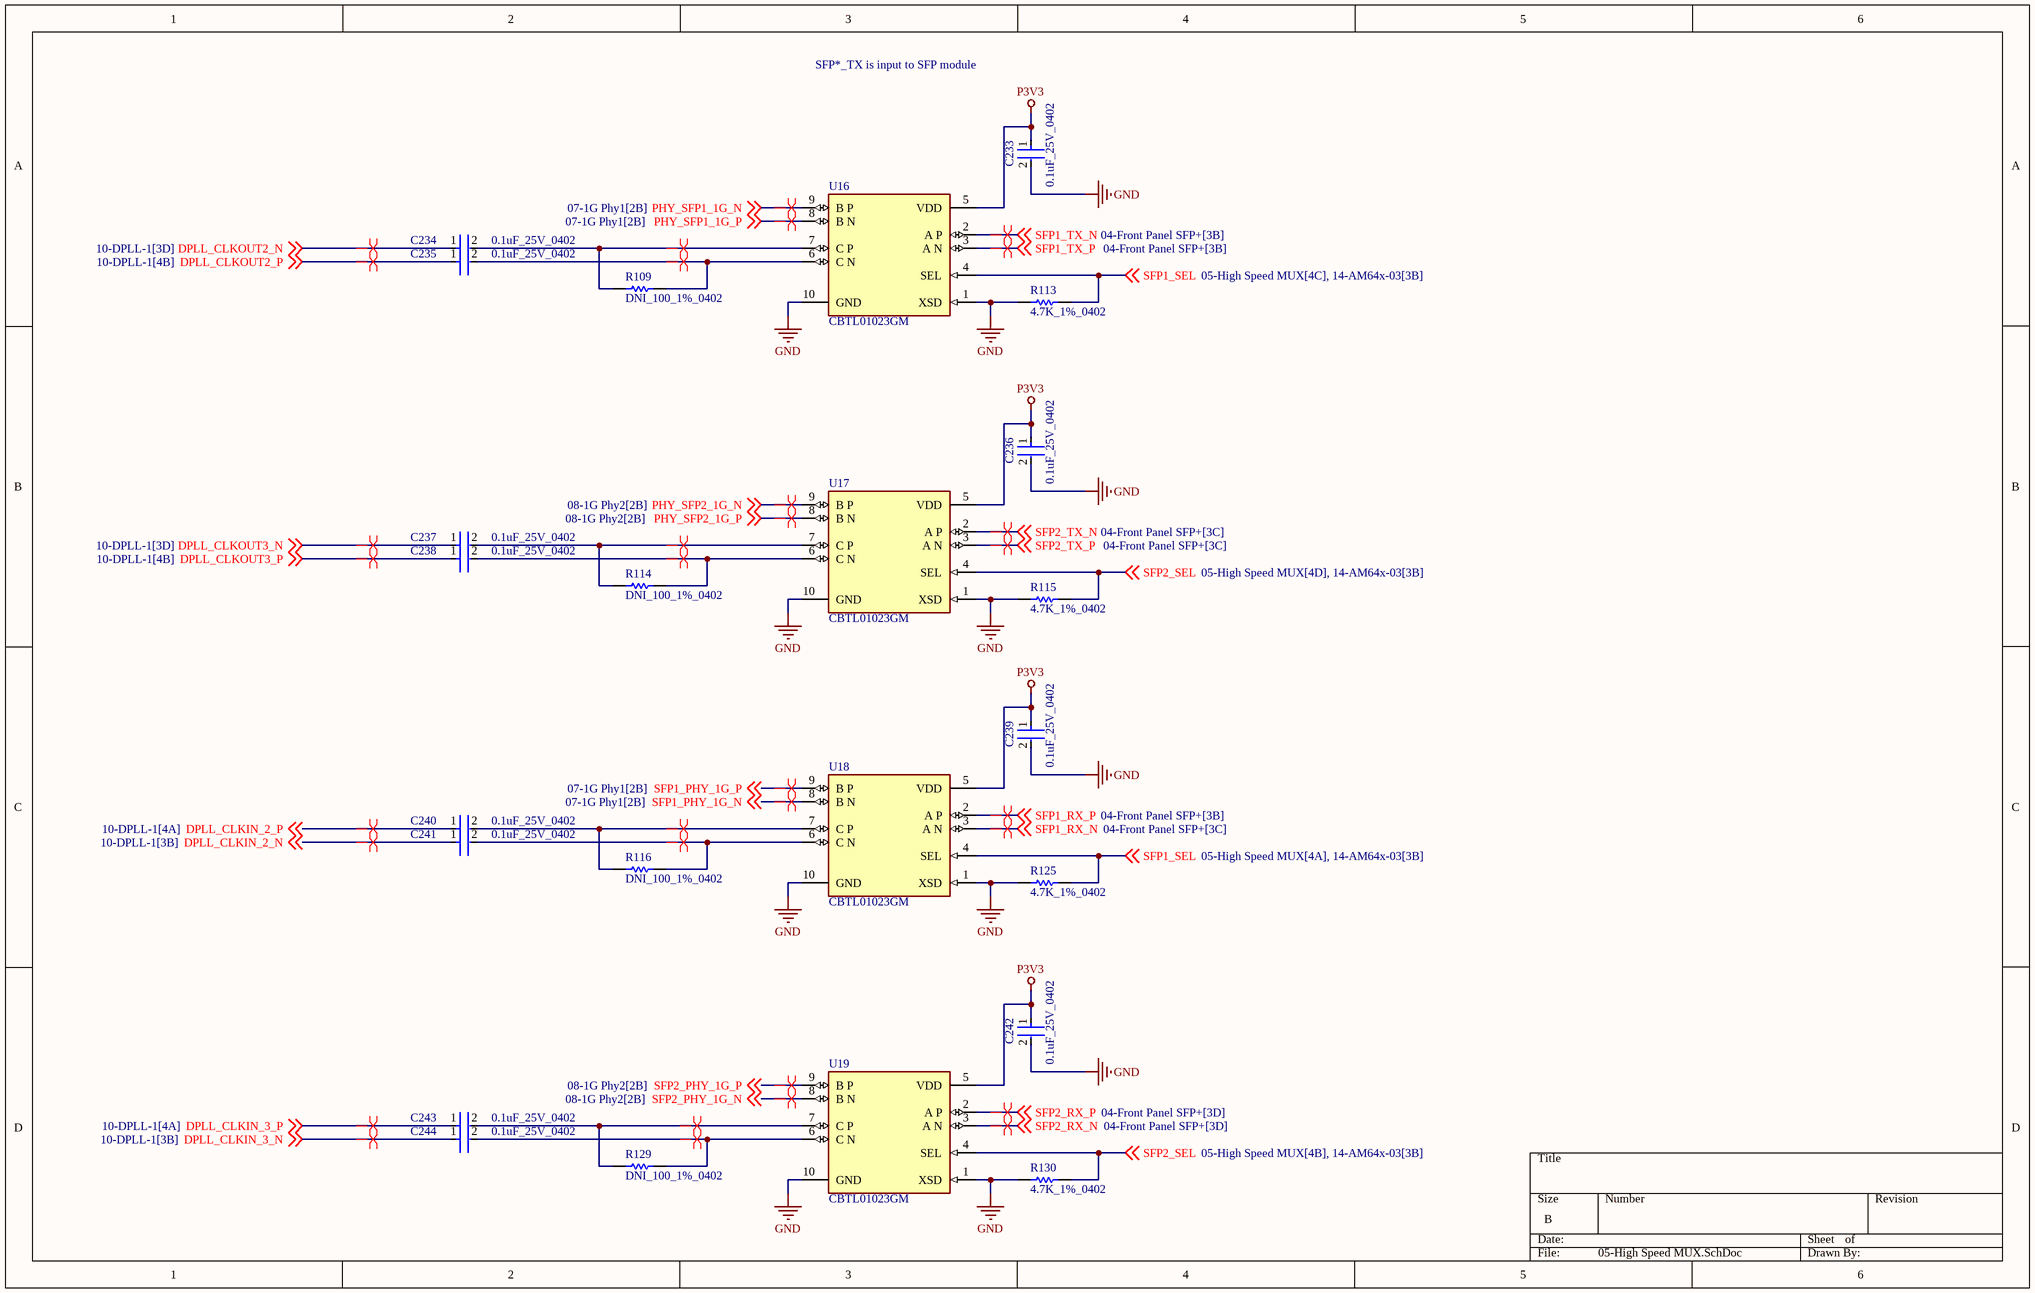
[diagram p4: 05-High Speed MUX.SchDoc]

### Parts
C233  0.1uF_25V_0402  [FP-0402-L_1_0_1-W_0_5_0_1-IPC_C]
C234  0.1uF_25V_0402  [FP-0402-L_1_0_1-W_0_5_0_1-IPC_C]
C235  0.1uF_25V_0402  [FP-0402-L_1_0_1-W_0_5_0_1-IPC_C]
C236  0.1uF_25V_0402  [FP-0402-L_1_0_1-W_0_5_0_1-IPC_C]
C237  0.1uF_25V_0402  [FP-0402-L_1_0_1-W_0_5_0_1-IPC_C]
C238  0.1uF_25V_0402  [FP-0402-L_1_0_1-W_0_5_0_1-IPC_C]
C239  0.1uF_25V_0402  [FP-0402-L_1_0_1-W_0_5_0_1-IPC_C]
C240  0.1uF_25V_0402  [FP-0402-L_1_0_1-W_0_5_0_1-IPC_C]
C241  0.1uF_25V_0402  [FP-0402-L_1_0_1-W_0_5_0_1-IPC_C]
C242  0.1uF_25V_0402  [FP-0402-L_1_0_1-W_0_5_0_1-IPC_C]
C243  0.1uF_25V_0402  [FP-0402-L_1_0_1-W_0_5_0_1-IPC_C]
C244  0.1uF_25V_0402  [FP-0402-L_1_0_1-W_0_5_0_1-IPC_C]
R109  DNI_100_1%_0402  [RESC1005X40X25LL05T10]  (no BOM)
R113  4.7K_1%_0402  [RESC1005X40X25NL10T10]
R114  DNI_100_1%_0402  [RESC1005X40X25LL05T10]  (no BOM)
R115  4.7K_1%_0402  [RESC1005X40X25NL10T10]
R116  DNI_100_1%_0402  [RESC1005X40X25LL05T10]  (no BOM)
R125  4.7K_1%_0402  [RESC1005X40X25NL10T10]
R129  DNI_100_1%_0402  [RESC1005X40X25LL05T10]  (no BOM)
R130  4.7K_1%_0402  [RESC1005X40X25NL10T10]
U16  CBTL01023GM  [FP-SOT1049-3-MFG]
U17  CBTL01023GM  [FP-SOT1049-3-MFG]
U18  CBTL01023GM  [FP-SOT1049-3-MFG]
U19  CBTL01023GM  [FP-SOT1049-3-MFG]

### Nets
GND: C233.2 C236.2 C239.2 C242.2 R113.1 R115.1 R125.1 R130.1 U16.1(XSD) U16.10(GND) U17.1(XSD) U17.10(GND) U18.1(XSD) U18.10(GND) U19.1(XSD) U19.10(GND)
P3V3: C233.1 C236.1 C239.1 C242.1 U16.5(VDD) U17.5(VDD) U18.5(VDD) U19.5(VDD)
DPLL_CLKIN_2_N: C241.1 ; off-sheet DPLL_CLKIN_2_N
DPLL_CLKIN_2_P: C240.1 ; off-sheet DPLL_CLKIN_2_P
DPLL_CLKIN_3_N: C244.1 ; off-sheet DPLL_CLKIN_3_N
DPLL_CLKIN_3_P: C243.1 ; off-sheet DPLL_CLKIN_3_P
DPLL_CLKOUT2_N: C234.1 ; off-sheet DPLL_CLKOUT2_N
DPLL_CLKOUT2_P: C235.1 ; off-sheet DPLL_CLKOUT2_P
DPLL_CLKOUT3_N: C237.1 ; off-sheet DPLL_CLKOUT3_N
DPLL_CLKOUT3_P: C238.1 ; off-sheet DPLL_CLKOUT3_P
PHY_SFP1_1G_N: U16.9(B_P) ; off-sheet PHY_SFP1_1G_N
PHY_SFP1_1G_P: U16.8(B_N) ; off-sheet PHY_SFP1_1G_P
PHY_SFP2_1G_N: U17.9(B_P) ; off-sheet PHY_SFP2_1G_N
PHY_SFP2_1G_P: U17.8(B_N) ; off-sheet PHY_SFP2_1G_P
SFP1_PHY_1G_N: U18.8(B_N) ; off-sheet SFP1_PHY_1G_N
SFP1_PHY_1G_P: U18.9(B_P) ; off-sheet SFP1_PHY_1G_P
SFP1_RX_N: U18.3(A_N) ; off-sheet SFP1_RX_N
SFP1_RX_P: U18.2(A_P) ; off-sheet SFP1_RX_P
SFP1_SEL: R113.2 R125.2 U16.4(SEL) U18.4(SEL) ; off-sheet SFP1_SEL
SFP1_TX_N: U16.2(A_P) ; off-sheet SFP1_TX_N
SFP1_TX_P: U16.3(A_N) ; off-sheet SFP1_TX_P
SFP2_PHY_1G_N: U19.8(B_N) ; off-sheet SFP2_PHY_1G_N
SFP2_PHY_1G_P: U19.9(B_P) ; off-sheet SFP2_PHY_1G_P
SFP2_RX_N: U19.3(A_N) ; off-sheet SFP2_RX_N
SFP2_RX_P: U19.2(A_P) ; off-sheet SFP2_RX_P
SFP2_SEL: R115.2 R130.2 U17.4(SEL) U19.4(SEL) ; off-sheet SFP2_SEL
SFP2_TX_N: U17.2(A_P) ; off-sheet SFP2_TX_N
SFP2_TX_P: U17.3(A_N) ; off-sheet SFP2_TX_P
NetC234_2: C234.2 R109.1 U16.7(C_P)
NetC235_2: C235.2 R109.2 U16.6(C_N)
NetC237_2: C237.2 R114.1 U17.7(C_P)
NetC238_2: C238.2 R114.2 U17.6(C_N)
NetC240_2: C240.2 R116.1 U18.7(C_P)
NetC241_2: C241.2 R116.2 U18.6(C_N)
NetC243_2: C243.2 R129.1 U19.7(C_P)
NetC244_2: C244.2 R129.2 U19.6(C_N)

### Layout directives
differential pair: DPLL_CLKIN_2_N, DPLL_CLKIN_2_P, DPLL_CLKIN_3_N, DPLL_CLKIN_3_P, DPLL_CLKOUT2_N, DPLL_CLKOUT2_P, DPLL_CLKOUT3_N, DPLL_CLKOUT3_P, NetC234_2, NetC235_2, NetC237_2, NetC238_2, NetC240_2, NetC241_2, NetC243_2, NetC244_2, PHY_SFP1_1G_N, PHY_SFP1_1G_P, PHY_SFP2_1G_N, PHY_SFP2_1G_P, SFP1_PHY_1G_N, SFP1_PHY_1G_P, SFP1_RX_N, SFP1_RX_P, SFP1_TX_N, SFP1_TX_P, SFP2_PHY_1G_N, SFP2_PHY_1G_P, SFP2_RX_N, SFP2_RX_P, SFP2_TX_N, SFP2_TX_P

### Notes on the sheet
- SFP*_TX is input to SFP module

### Library data of the parts
C233-C244 = CMP-2008-02519-2: as C26 on sheet 02-USER_IO; Package Quantity: 1; Capacitance: 100nF; Min Operating Temperature: -55°C; Voltage: 25V; Voltage Rating: 25V; Construction: Flat; Max Operating Temperature: 125°C; Radiation Hardening: No; Depth: 0.5mm; Thickness: 0.022inch; Voltage Rating (DC): 25V; Number of Pins: 2; Lead Free: Lead Free; Series: -; REACH SVHC: No SVHC; Length: 1mm; Dielectric: X7R; RoHS Compliant: Yes; Mount: Surface Mount; Packaging: Tape and Reel; Case/Package: 0402; Case Code (Imperial): 0402; Termination: SMD/SMT; Width: 0.02inch; Case Code (Metric): 1005; Tolerance: 10%
R109 R114 R116 R129 = CMP-2002-03042-1: Manufacturer: Vishay Dale; Part Number: CRCW0402100RFKEDHP
R113 R115 R125 R130 = CMP-2002-05217-1: as R22 on sheet 01-PCIe
U16-U19 = CMP-10118-000007-1: DisplayPort, PCIe, USB Switch IC 1 Channel 10-XQFN (1.55x2); RoHS Compliant: Yes

## Sheet 06-1G Phy0.SchDoc
size B; SheetNumber: 6; SheetTotal: 25; SPICEModelCacheVZIIJVTD: <root> / <DocumentId>VZIIJVTD</DocumentId> / <CacheFrame Number="0"> / <Model Name="emk105bj105_v-f" Kind="CKT"> / <Text>* EMK105BJ105_V-F     SPICE MODEL  ( General Type ) / *-------------------------------------------------------------------------------------------------------- / * Model Generated by TAIYO YUDEN Corporation (http://www.ty-top.com) / * Version 1.0 / * TAIYO YUDEN Control No. 170508_130520 / * Copyright(c) 2012 TAIYO YUDEN CO.,LTD. All Rights Reserved. / *-------------------------------------------------------------------------------------------------------- / * / * Products Name : Multilayer Ceramic Capacitors / * / * Characteristics : / *     Capacitance : 1 uF , Rated Voltage : 16V , TCC : X5R / *     Case Size : 1.0 x 0.5 / 0.039 x 0.02 [mm/inch] , Thickness : 0.5 / 0.02 [mm/inch] / *     (Conditions: Temperature = 25 degC , DC Bias Current/Voltage = 0A / 0V) / * / * Frequency Range : 40Hz - 3GHz / * / * External Node Assignments : / * / *  1  o---| |---o  2 / * / *-------------------------------------------------------------------------------------------------------- / .SubCkt EMK105BJ105_V-F 1 2 / **************************** / C0 1 110 0.68309u / Cm 1 101 0.26053u / C1 101 102 0.94076u / Rc1 101 102 1.9029k / C2 102 103 0.66707u / Rc2 102 103 120.36 / C3 103 110 0.57203u / Rc3 103 110 2.1097 / C2m 1 301 0.1871u / C21 301 302 3.2494u / Rc21 301 302 1.1117k / C22 302 303 2.1014u / Rc22 302 303 1.484k / C23 303 304 2.1172u / Rc23 303 304 1.3876k / C24 304 305 0.75729u / Rc24 304 305 332.59 / C25 305 306 0.94401u / Rc25 305 306 249.09 / C26 306 307 0.34674u / Rc26 306 307 28.352 / C27 307 308 0.37158u / Rc27 307 308 19.989 / C28 308 309 0.17933u / Rc28 308 309 31.748 / C29 309 110 0.016445u / Rc29 309 110 1.0592 / Rp0 1 110 100Meg / L0 110 120 0.2216n / Lm 120 130 0.1509n / L1 120 121 0.12659n / RL1 121 130 0.85161 / L2 120 122 0.15996n / RL2 122 130 0.42469 / L3 120 123 7.9543n / RL3 123 130 0.54643m / CR 120 124 0.24334u / LR 124 125 0.090738n / RR 125 130 68.076m / CL 130 140 2.7354p / LL 130 140 0.10762n / RL 130 140 50.614 / Rs 140 2 7.5416m / **************************** / .ends EMK105BJ105_V-F</Text> / </Model> / </CacheFrame> / </root>
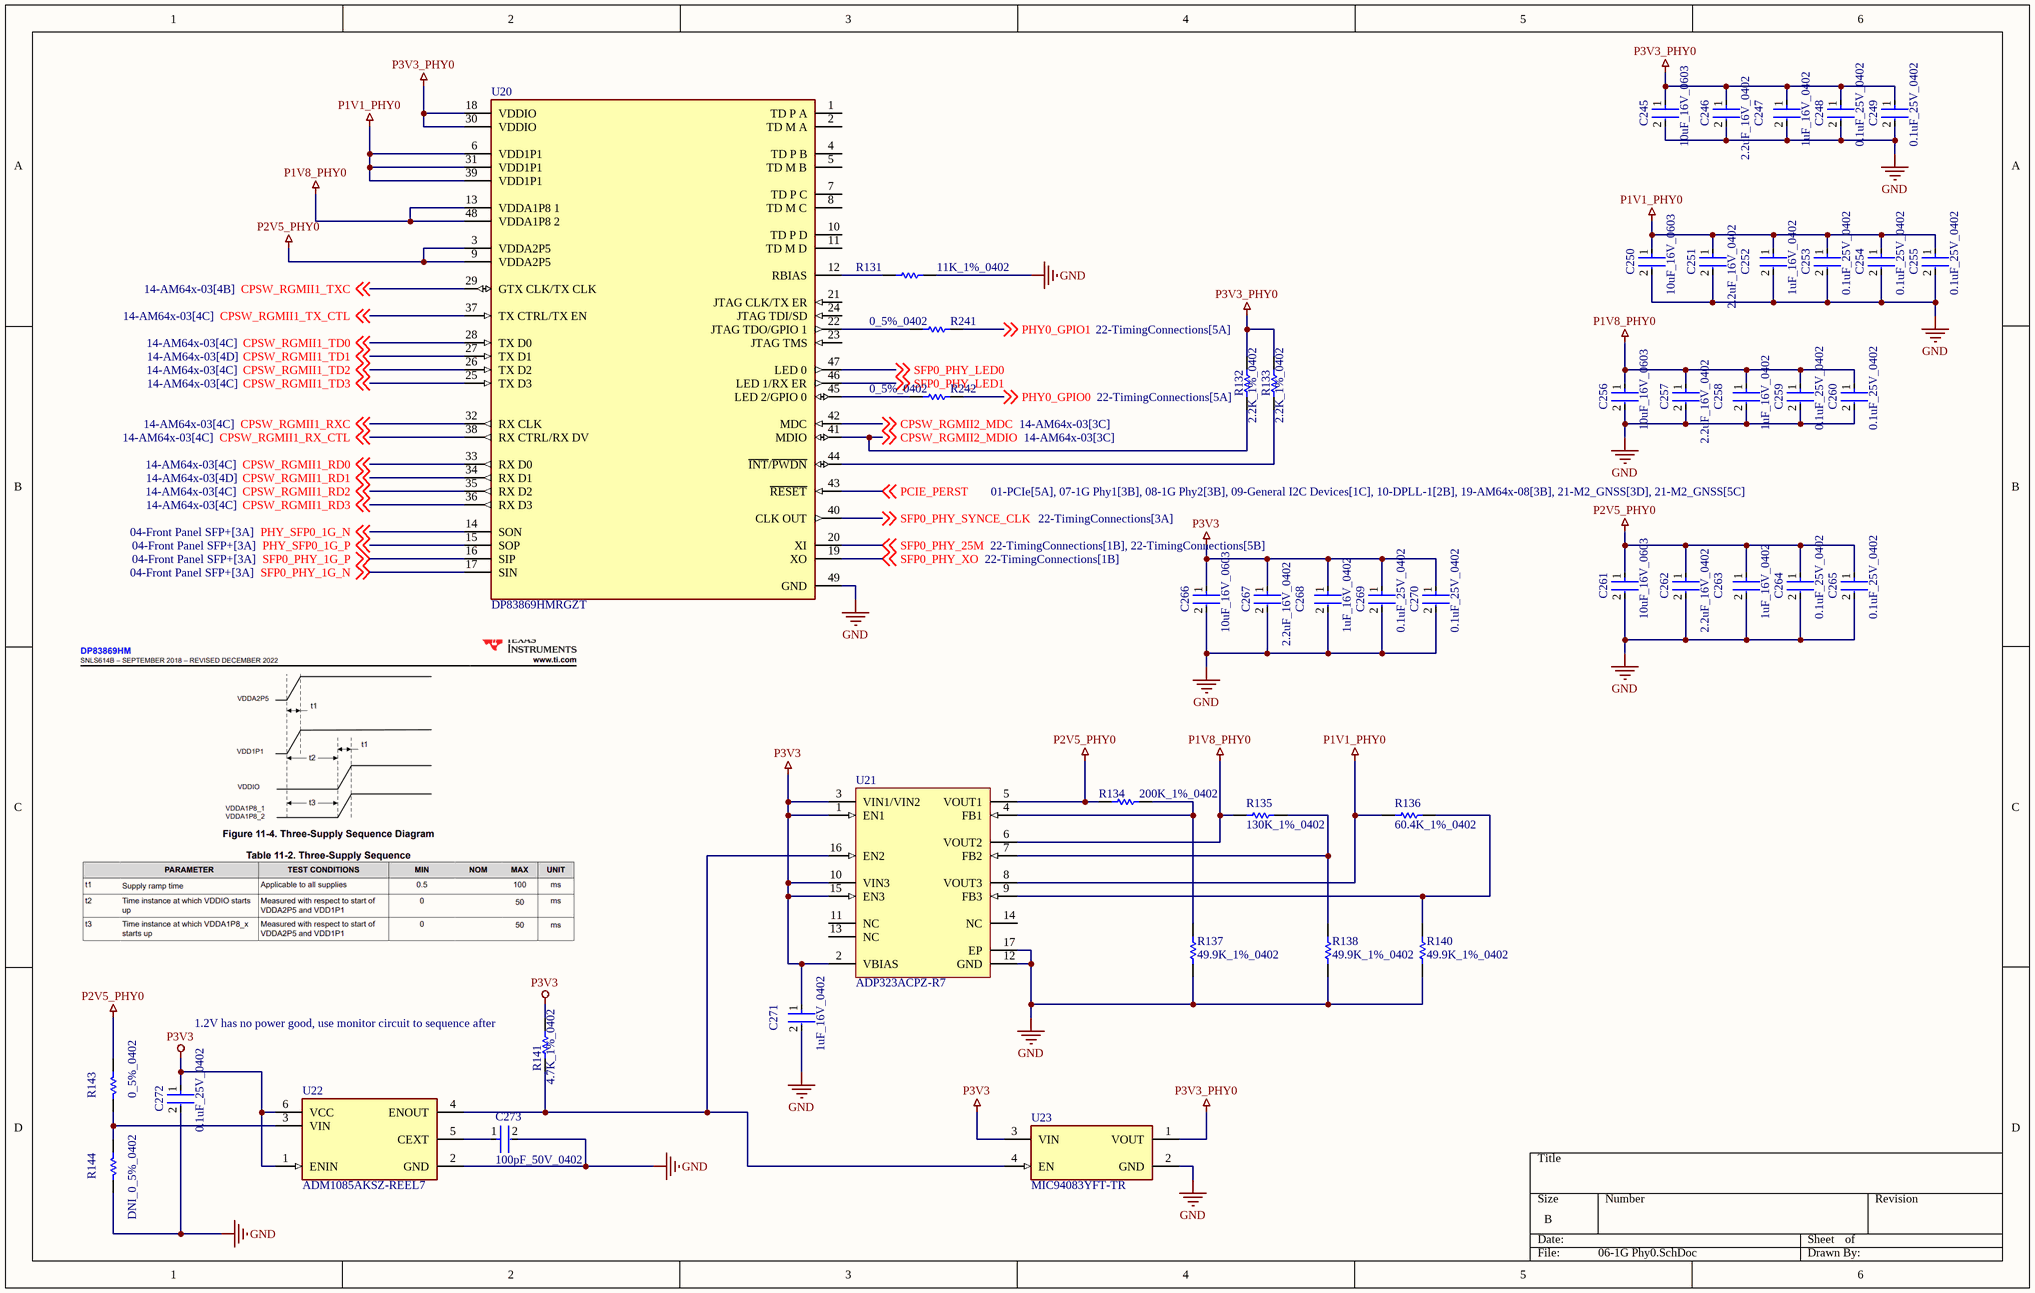
[diagram p5: 06-1G Phy0.SchDoc]

### Parts
C245  10uF_16V_0603  [FP-0603-L_1_6_0_2-W_0_8_0-MFG]
C246  2.2uF_16V_0402  [FP-C1005-050-0_05-IPC_A]
C247  1uF_16V_0402  [FP-0402-L_1_0_0_05-W_0_5-IPC_A]
C248  0.1uF_25V_0402  [FP-0402-L_1_0_1-W_0_5_0_1-IPC_C]
C249  0.1uF_25V_0402  [FP-0402-L_1_0_1-W_0_5_0_1-IPC_C]
C250  10uF_16V_0603  [FP-0603-L_1_6_0_2-W_0_8_0-MFG]
C251  2.2uF_16V_0402  [FP-C1005-050-0_05-IPC_A]
C252  1uF_16V_0402  [FP-0402-L_1_0_0_05-W_0_5-IPC_A]
C253  0.1uF_25V_0402  [FP-0402-L_1_0_1-W_0_5_0_1-IPC_C]
C254  0.1uF_25V_0402  [FP-0402-L_1_0_1-W_0_5_0_1-IPC_C]
C255  0.1uF_25V_0402  [FP-0402-L_1_0_1-W_0_5_0_1-IPC_C]
C256  10uF_16V_0603  [FP-0603-L_1_6_0_2-W_0_8_0-MFG]
C257  2.2uF_16V_0402  [FP-C1005-050-0_05-IPC_A]
C258  1uF_16V_0402  [FP-0402-L_1_0_0_05-W_0_5-IPC_A]
C259  0.1uF_25V_0402  [FP-0402-L_1_0_1-W_0_5_0_1-IPC_C]
C260  0.1uF_25V_0402  [FP-0402-L_1_0_1-W_0_5_0_1-IPC_C]
C261  10uF_16V_0603  [FP-0603-L_1_6_0_2-W_0_8_0-MFG]
C262  2.2uF_16V_0402  [FP-C1005-050-0_05-IPC_A]
C263  1uF_16V_0402  [FP-0402-L_1_0_0_05-W_0_5-IPC_A]
C264  0.1uF_25V_0402  [FP-0402-L_1_0_1-W_0_5_0_1-IPC_C]
C265  0.1uF_25V_0402  [FP-0402-L_1_0_1-W_0_5_0_1-IPC_C]
C266  10uF_16V_0603  [FP-0603-L_1_6_0_2-W_0_8_0-MFG]
C267  2.2uF_16V_0402  [FP-C1005-050-0_05-IPC_A]
C268  1uF_16V_0402  [FP-0402-L_1_0_0_05-W_0_5-IPC_A]
C269  0.1uF_25V_0402  [FP-0402-L_1_0_1-W_0_5_0_1-IPC_C]
C270  0.1uF_25V_0402  [FP-0402-L_1_0_1-W_0_5_0_1-IPC_C]
C271  1uF_16V_0402  [FP-0402-L_1_0_0_05-W_0_5-IPC_A]
C272  0.1uF_25V_0402  [FP-0402-L_1_0_1-W_0_5_0_1-IPC_C]
C273  100pF_50V_0402  [FP-C0402-BB-MFG]
R131  11K_1%_0402  [RESC1005X40X25LL05T10]
R132  2.2K_1%_0402  [RESC1005X40X25ML10T10]
R133  2.2K_1%_0402  [RESC1005X40X25ML10T10]
R134  200K_1%_0402  [RESC1005X40X25LL10T10]
R135  130K_1%_0402  [RESC1005X40X25NL10T10]
R136  60.4K_1%_0402  [RESC1005X40X25LL05T10]
R137  49.9K_1%_0402  [RESC1005X40X25LL10T10]
R138  49.9K_1%_0402  [RESC1005X40X25LL10T10]
R140  49.9K_1%_0402  [RESC1005X40X25LL10T10]
R141  4.7K_1%_0402  [RESC1005X40X25NL10T10]
R143  0_5%_0402  [RESC1005X40X25LL10T10]
R144  DNI_0_5%_0402  [RESC1005X40X25LL10T10]  (no BOM)
R241  0_5%_0402  [RESC1005X40X25LL10T10]
R242  0_5%_0402  [RESC1005X40X25LL10T10]
U20  DP83869HMRGZT  [FP-RGZ0048B-IPC_A]
U21  ADP323ACPZ-R7  [ADI-CP-16-27_N]
U22  ADM1085AKSZ-REEL7  [FP-KS-6-IPC_B]
U23  MIC94083YFT-TR  [FP-FTDFN085085-4LD-PL-1-MFG]

### Nets
GND: C245.2 C246.2 C247.2 C248.2 C249.2 C250.2 C251.2 C252.2 C253.2 C254.2 C255.2 C256.2 C257.2 C258.2 C259.2 C260.2 C261.2 C262.2 C263.2 C264.2 C265.2 C266.2 C267.2 C268.2 C269.2 C270.2 C271.2 C272.2 C273.2 R131.2 R137.1 R138.1 R140.1 R144.2 U20.49(GND) U21.12(GND) U21.17(EP) U22.2(GND) U23.2(GND)
P1V1_PHY0: C250.1 C251.1 C252.1 C253.1 C254.1 C255.1 R136.1 U20.6(VDD1P1) U20.31(VDD1P1) U20.39(VDD1P1) U21.8(VOUT3)
P1V8_PHY0: C256.1 C257.1 C258.1 C259.1 C260.1 R135.1 U20.13(VDDA1P8_1) U20.48(VDDA1P8_2) U21.6(VOUT2)
P2V5_PHY0: C261.1 C262.1 C263.1 C264.1 C265.1 R134.1 R143.1 U20.3(VDDA2P5) U20.9(VDDA2P5) U21.5(VOUT1)
P3V3: C266.1 C267.1 C268.1 C269.1 C270.1 C271.1 C272.1 R141.1 U21.1(EN1) U21.2(VBIAS) U21.3(VIN1/VIN2) U21.10(VIN3) U21.15(EN3) U22.1(ENIN) U22.6(VCC) U23.3(VIN)
P3V3_PHY0: C245.1 C246.1 C247.1 C248.1 C249.1 R132.2 R133.2 U20.18(VDDIO) U20.30(VDDIO) U23.1(VOUT)
CPSW_RGMII1_RD0: U20.33(RX_D0) ; off-sheet CPSW_RGMII1_RD0
CPSW_RGMII1_RD1: U20.34(RX_D1) ; off-sheet CPSW_RGMII1_RD1
CPSW_RGMII1_RD2: U20.35(RX_D2) ; off-sheet CPSW_RGMII1_RD2
CPSW_RGMII1_RD3: U20.36(RX_D3) ; off-sheet CPSW_RGMII1_RD3
CPSW_RGMII1_RX_CTL: U20.38(RX_CTRL/RX_DV) ; off-sheet CPSW_RGMII1_RX_CTL
CPSW_RGMII1_RXC: U20.32(RX_CLK) ; off-sheet CPSW_RGMII1_RXC
CPSW_RGMII1_TD0: U20.28(TX_D0) ; off-sheet CPSW_RGMII1_TD0
CPSW_RGMII1_TD1: U20.27(TX_D1) ; off-sheet CPSW_RGMII1_TD1
CPSW_RGMII1_TD2: U20.26(TX_D2) ; off-sheet CPSW_RGMII1_TD2
CPSW_RGMII1_TD3: U20.25(TX_D3) ; off-sheet CPSW_RGMII1_TD3
CPSW_RGMII1_TX_CTL: U20.37(TX_CTRL/TX_EN) ; off-sheet CPSW_RGMII1_TX_CTL
CPSW_RGMII1_TXC: U20.29(GTX_CLK/TX_CLK) ; off-sheet CPSW_RGMII1_TXC
CPSW_RGMII2_MDC: U20.42(MDC) ; off-sheet CPSW_RGMII2_MDC
CPSW_RGMII2_MDIO: R132.1 U20.41(MDIO) ; off-sheet CPSW_RGMII2_MDIO
PCIE_PERST: U20.43(~{RESET}) ; off-sheet PCIE_PERST
PHY0_GPIO0: R242.2 ; off-sheet PHY0_GPIO0
PHY0_GPIO1: R241.2 ; off-sheet PHY0_GPIO1
PHY_SFP0_1G_N: U20.14(SON) ; off-sheet PHY_SFP0_1G_N
PHY_SFP0_1G_P: U20.15(SOP) ; off-sheet PHY_SFP0_1G_P
SFP0_PHY_1G_N: U20.17(SIN) ; off-sheet SFP0_PHY_1G_N
SFP0_PHY_1G_P: U20.16(SIP) ; off-sheet SFP0_PHY_1G_P
SFP0_PHY_25M: U20.20(XI) ; off-sheet SFP0_PHY_25M
SFP0_PHY_LED0: U20.47(LED_0) ; off-sheet SFP0_PHY_LED0
SFP0_PHY_LED1: U20.46(LED_1/RX_ER) ; off-sheet SFP0_PHY_LED1
SFP0_PHY_SYNCE_CLK: U20.40(CLK_OUT) ; off-sheet SFP0_PHY_SYNCE_CLK
SFP0_PHY_XO: U20.19(XO) ; off-sheet SFP0_PHY_XO
NetC273_1: C273.1 U22.5(CEXT)
NetR131_1: R131.1 U20.12(RBIAS)
NetR133_1: R133.1 U20.44(~{INT}/~{PWDN})
NetR134_2: R134.2 R137.2 U21.4(FB1)
NetR135_2: R135.2 R138.2 U21.7(FB2)
NetR136_2: R136.2 R140.2 U21.9(FB3)
NetR141_2: R141.2 U21.16(EN2) U22.4(ENOUT) U23.4(EN)
NetR143_2: R143.2 R144.1 U22.3(VIN)
NetR241_1: R241.1 U20.22(JTAG_TDO/GPIO_1)
NetR242_1: R242.1 U20.45(LED_2/GPIO_0)

Not connected (* = marked no-connect by the designer): U20 1(TD_P_A) 2(TD_M_A) 4(TD_P_B) 5(TD_M_B) 7(TD_P_C) 8(TD_M_C) 10(TD_P_D) 11(TD_M_D) 21(JTAG_CLK/TX_ER) 23(JTAG_TMS) 24(JTAG_TDI/SD); U21 11(NC) 13(NC) 14(NC)

### Notes on the sheet
- (near R141) 1.2V has no power good, use monitor circuit to sequence after

### Library data of the parts
C245 C250 C256 C261 C266 = CMP-2000-06226-4: Multilayer Ceramic Capacitor 10uF 16V X5R 20% SMD 0603 T/R; Packaging: Tape and Reel; Construction: Flat; Height: 0.8mm; Max Operating Temperature: 85°C; Dielectric: X5R; Case Code (Metric): 1608; Voltage Rating (DC): 16V; Width: 0.031inch; Voltage Rating: 16V; Length: 0.063inch; RoHS Compliant: Yes; Halogen Free: Halogen Free; Case Code (Imperial): 0603; Capacitance: 10uF; Mount: Surface Mount; Thickness: 0.031inch; Tolerance: 20%; Min Operating Temperature: -55°C; Series: M; Termination: SMD/SMT; Case/Package: 0603; Package Quantity: 1
C246 C251 C257 C262 C267 = CMP-2000-05998-2: Multilayer Ceramic Capacitors 2.2μF ±10% 16V X5R SMD 0402; Capacitance: 2.2uF; REACH SVHC: No SVHC; Series: C; Termination: SMD/SMT; Case Code (Imperial): 0402; Depth: 0.5mm; Mount: Surface Mount; Width: 0.02inch; Package Quantity: 1; Dielectric Material: Ceramic; Length: 1mm; Packaging: Tape and Reel; Case Code (Metric): 1005; RoHS Compliant: Yes; Dielectric: X5R; Max Operating Temperature: 85°C; Lead Free: Lead Free; Weight: 2.3E-05oz; Thickness: 0.022inch; Voltage Rating (DC): 16V; Tolerance: 10%; Voltage Rating: 16V; Resistor Type: Ceramic; Height: 0.5mm; Case/Package: 0402; Min Operating Temperature: -55°C
C247 C252 C258 C263 C268 C271 = CMP-14477-000104-2: None; Tolerance: 10%; Voltage Rating: 16V; Dielectric: X5R; Capacitance: 1uF; Packaging: Tape and Reel; Depth: 0.5mm; Mount: Surface Mount; Thickness: 0.022inch; Package Quantity: 1; Min Operating Temperature: -55°C; Series: M; Voltage Rating (DC): 16V; Termination: SMD/SMT; Case/Package: 0402; Number of Pins: 2; Case Code (Imperial): 0402; Length: 1mm; Halogen Free: Halogen Free; Case Code (Metric): 1005; Width: 0.02inch; RoHS Compliant: Yes; Radiation Hardening: No; Max Operating Temperature: 85°C; Height: 0.5mm; Construction: Flat
C248 C249 C253-C255 C259 C260 C264 C265 C269 C270 C272 = CMP-2008-02519-2: as C26 on sheet 02-USER_IO; Package Quantity: 1; Capacitance: 100nF; Min Operating Temperature: -55°C; Voltage: 25V; Voltage Rating: 25V; Construction: Flat; Max Operating Temperature: 125°C; Radiation Hardening: No; Depth: 0.5mm; Thickness: 0.022inch; Voltage Rating (DC): 25V; Number of Pins: 2; Lead Free: Lead Free; Series: -; REACH SVHC: No SVHC; Length: 1mm; Dielectric: X7R; RoHS Compliant: Yes; Mount: Surface Mount; Packaging: Tape and Reel; Case/Package: 0402; Case Code (Imperial): 0402; Termination: SMD/SMT; Width: 0.02inch; Case Code (Metric): 1005; Tolerance: 10%
C273 = CMP-2008-03417-2: CAP CER 100PF 50V C0G/NP0 0402; Manufacturer: Kemet; Manufacturer Part Number: C0402C101G5GACTU; Material: Ceramic; Temperature Characteristic: C0G; Tolerance: 0.02; Temperature Coefficient: 15%; Temperature Range High: +125°C; Lead Free: Yes; Capacitance: 100 pF; Value: 100 pF; ComponentLink2URL: https://content.kemet.com/datasheets/KEM_C1002_X7R_SMD.pdf; Automotive: No; Voltage Rating: 50 V; Category: Cap; Device Class L2: Capacitors; ComponentLink2Description: Datasheet; Mouser Description: Multilayer Ceramic Capacitors MLCC - SMD/SMT 50volts 100pF C0G 2%; RoHS: TRUE; Device Class L3: Ceramic Capacitors; Temperature Range Low: -55°C; Octopart: https://octopart.com/c0402c101g5gactu-kemet-16782744; Height: 0.55mm; Ipc Land Pattern Name: CAPC10050X50; Package: C0402-BB; Device Class L1: Passive Components; Temperature: -55°C to +125°C; Digikey Description: CAP CER 100PF 50V C0G/NP0 0402
R131 = CMP-2002-07365-1: Manufacturer: Yageo / Phycomp; Part Number: RC0402FR-0711KL
R132 R133 = CMP-2002-06097-1: Part Number: MC00625W040212K2; Manufacturer: Multicomp
R134 = CMP-2002-04904-1: Part Number: CR0402-FX-2003GLF; Manufacturer: Bourns
R135 = CMP-2002-05688-1: Part Number: CRG0402F130K; Manufacturer: TE Connectivity / AMP
R136 = CMP-2002-07763-1: Manufacturer: Yageo / Phycomp; Part Number: RC0402FR-0760K4L
R137 R138 R140 = CMP-1011-00702-2: Manufacturer: Bourns; Part Number: CR0402-FX-4992GLF
R141 = CMP-2002-05217-1: as R22 on sheet 01-PCIe
R143 R144 R241 R242 = CMP-2002-04569-1: as R23 on sheet 01-PCIe
U20 = CMP-04874-000002-2: IC TRANSCEIVER 1/1 48FN; RoHS Compliant: Yes
U21 = CMP-0786-00062-1: Triple, 200 mA, Low Noise, High PSRR Voltage Regulator, 2.5 to 5.5 V Vin, Adjustable Vout, Industrial, 16-pin QFN (CP-16-27), Reel; Manufacturer: Analog Devices; Vout Adjustable Range: 0.5V to 5V; Iout max: 200mA; Vin (max) (V): 5.5; Supply Current IGND @ Small Load: 85uA; Vin (min) (V): 2.5; ComponentLink2URL: http://www.analog.com/static/imported-files/data_sheets/ADP322_323.pdf; Code_JEDEC: MO-229; Mounting Technology: Surface Mount; DatasheetVersion: Rev. A; PartNumber: ADP323ACPZ-R7; ComponentLink3URL: http://www.analog.com/static/imported-files/packages/PKG_PDF/LFCSP(CP)/CP_16_27.pdf; ComponentLink4Description: URL Link1; PackageVersion: 091609-A, 09/2009; ComponentLink1Description: Manufacturer URL; ComponentLink3Description: Package Specification; Packing: Reel; PackageReference: CP-16-27; ComponentLink4URL: Product URL:http://www.analog.com/en/ADP323/productSearch.html; ComponentLink1URL: http://www.analog.com/en/index.html; PackageDescription: 16-Pin Lead Frame Chip Scale Package, Body 3 x 3 mm, Pitch 0.5 mm; ComponentLink2Description: Datasheet
U22 = CMP-09140-000008-1: IC SUPERVISOR 1 CHANNEL SC70-6; Min Reset Threshold Voltage: 560mV; Operating Supply Voltage: 125V; Operating Supply Current: 10uA; Reset: Active High; Max Reset Threshold Voltage: 640mV; Watchdog Timer: No; Min Supply Voltage: 2.25V; Number of Voltages Monitored: 1; Max Supply Current: 15uA; Threshold Voltage: 600mV; Max Supply Voltage: 3.6V; Nominal Supply Current: 10uA; Mount: Surface Mount; Width: 1.35mm; Max Operating Temperature: 125°C; Lead Free: Contains Lead; Package Quantity: 3000; Undervoltage Threshold: 560mV; Type: Sequencer; Packaging: Tape and Reel; Min Operating Temperature: -40°C; Radiation Hardening: No; REACH SVHC: No SVHC; Overvoltage Threshold: 640mV; Number of Pins: 6; Case/Package: SC; Length: 2.2mm; Height: 1mm; Number of Monitored Inputs: 1
U23 = CMP-06317-000053-1: IC PWR SWITCH P-CHAN 1:1 4TMLF; Turn-On Delay Time: 1.5us; Turn-Off Delay Time: 200ns; On-State Resistance: 67mR; Output Current: 2A; Min Supply Voltage: 1.7V; Number of Outputs: 1; Interface: On/Off; Output Configuration: High Side; Max Supply Voltage: 5.5V; Radiation Hardening: No; Min Operating Temperature: -40°C; Mount: Surface Mount; Series: -; RoHS Compliant: Yes; Number of Pins: 4; Reach SVHC Compliant: Yes; On-state Resistance-Max: 67MR; Package Quantity: 5000; Packaging: Tape and Reel; Max Output Current: 2A; Supply Current: 2A; Lead Free: Lead Free; Current Rating: 2A; Max Operating Temperature: 125°C; Rated Current-Max: 2A; Nominal Supply Current: 2A